# EAGLE design Wobbler_Rev1 (EAGLE 7.7.0)

## Sheet 1 of 5: MCU & Eeprom
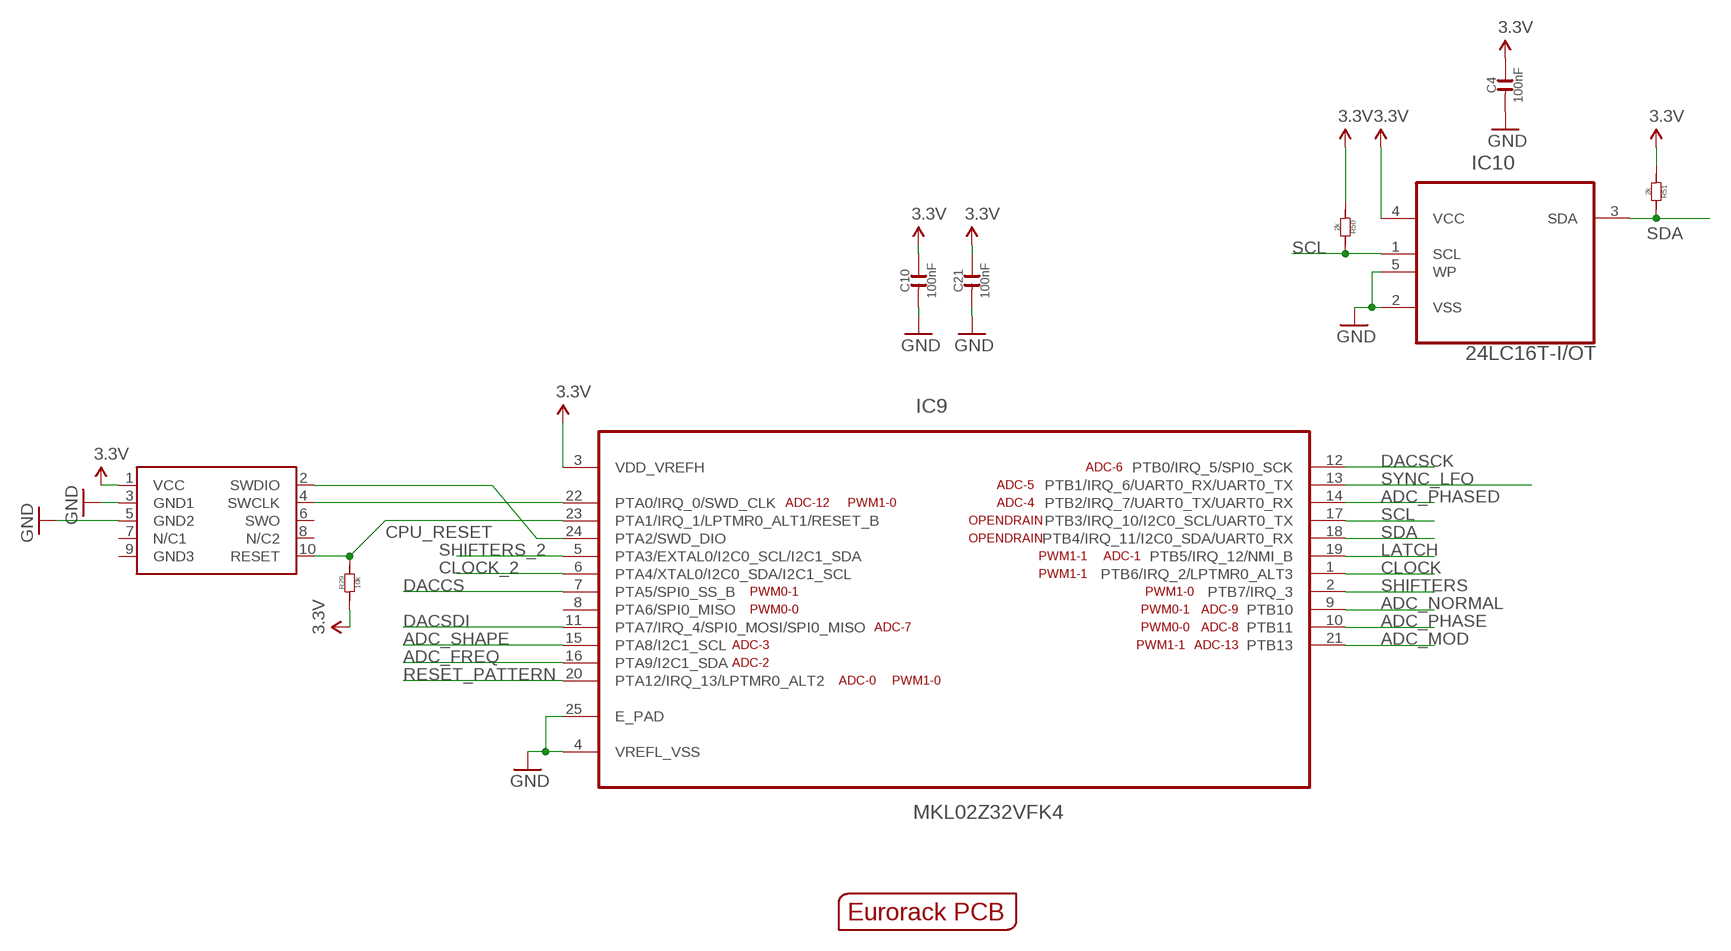
[diagram p0: schematic, sheet 1]

### Parts
C4  100nF  C-0603  [C0603]
C10  100nF  C-0603  [C0603]
C21  100nF  C-0603  [C0603]
IC9  MKL02Z32VFK4  [QFN50P400X400X100-25N]
IC10  24LC16T-I/OT  24LC00T-I/OT  [SOT95P290X145-5N]
OUTLINE  EURORACK_PCB12HP  [EURORACK12HPPCB]
R29  10k  R-0603  [R0603]
R50  2k  R-0603  [R0603]
R51  2k  R-0603  [R0603]
SWD1  CORTEX_SWD  [M50-3600542]

### Nets
3.3V [heavypower]: C4.2 C10.2 C21.2 IC9.3(VDD_VREFH) IC10.4(VCC) R29.1 R50.1 R51.1 SWD1.1(VCC) ; also sheet 2,3,4,5
ADC_FREQ: IC9.16(PTA9/I2C1_SDA) ; also sheet 5
ADC_MOD: IC9.21(PTB13) ; also sheet 5
ADC_NORMAL: IC9.9(PTB10) ; also sheet 5
ADC_PHASE: IC9.10(PTB11) ; also sheet 5
ADC_PHASED: IC9.14(PTB2/IRQ_7/UART0_TX/UART0_RX) ; also sheet 5
ADC_SHAPE: IC9.15(PTA8/I2C1_SCL) ; also sheet 5
CLOCK: IC9.1(PTB6/IRQ_2/LPTMR0_ALT3) ; also sheet 2
CLOCK_2: IC9.6(PTA4/XTAL0/I2C0_SDA/I2C1_SCL) ; also sheet 2
CPU_RESET: IC9.23(PTA1/IRQ_1/LPTMR0_ALT1/RESET_B) R29.2 SWD1.10(RESET)
DACCS: IC9.7(PTA5/SPI0_SS_B) ; also sheet 3
DACSCK: IC9.12(PTB0/IRQ_5/SPI0_SCK) ; also sheet 3
DACSDI: IC9.11(PTA7/IRQ_4/SPI0_MOSI/SPI0_MISO) ; also sheet 3
GND [groundplane]: C4.1 C10.1 C21.1 IC9.4(VREFL_VSS) IC9.25(E_PAD) IC10.2(VSS) IC10.5(WP) SWD1.3(GND1) SWD1.5(GND2) ; also sheet 2,3,4,5
LATCH: IC9.19(PTB5/IRQ_12/NMI_B) ; also sheet 2
RESET_PATTERN: IC9.20(PTA12/IRQ_13/LPTMR0_ALT2) ; also sheet 2,5
SCL: IC9.17(PTB3/IRQ_10/I2C0_SCL/UART0_TX) IC10.1(SCL) R50.2
SDA: IC9.18(PTB4/IRQ_11/I2C0_SDA/UART0_RX) IC10.3(SDA) R51.2
SHIFTERS: IC9.2(PTB7/IRQ_3) ; also sheet 2
SHIFTERS_2: IC9.5(PTA3/EXTAL0/I2C0_SCL/I2C1_SDA) ; also sheet 2
SWD_CLK: IC9.22(PTA0/IRQ_0/SWD_CLK) SWD1.4(SWCLK)
SWD_DIO: IC9.24(PTA2/SWD_DIO) SWD1.2(SWDIO)
SYNC_LFO: IC9.13(PTB1/IRQ_6/UART0_RX/UART0_TX) ; also sheet 5
Unconnected: IC9.8(PTA6/SPI0_MISO) SWD1.6(SWO) SWD1.7(N/C1) SWD1.8(N/C2) SWD1.9(GND3)

## Sheet 2 of 5: LEDs & button
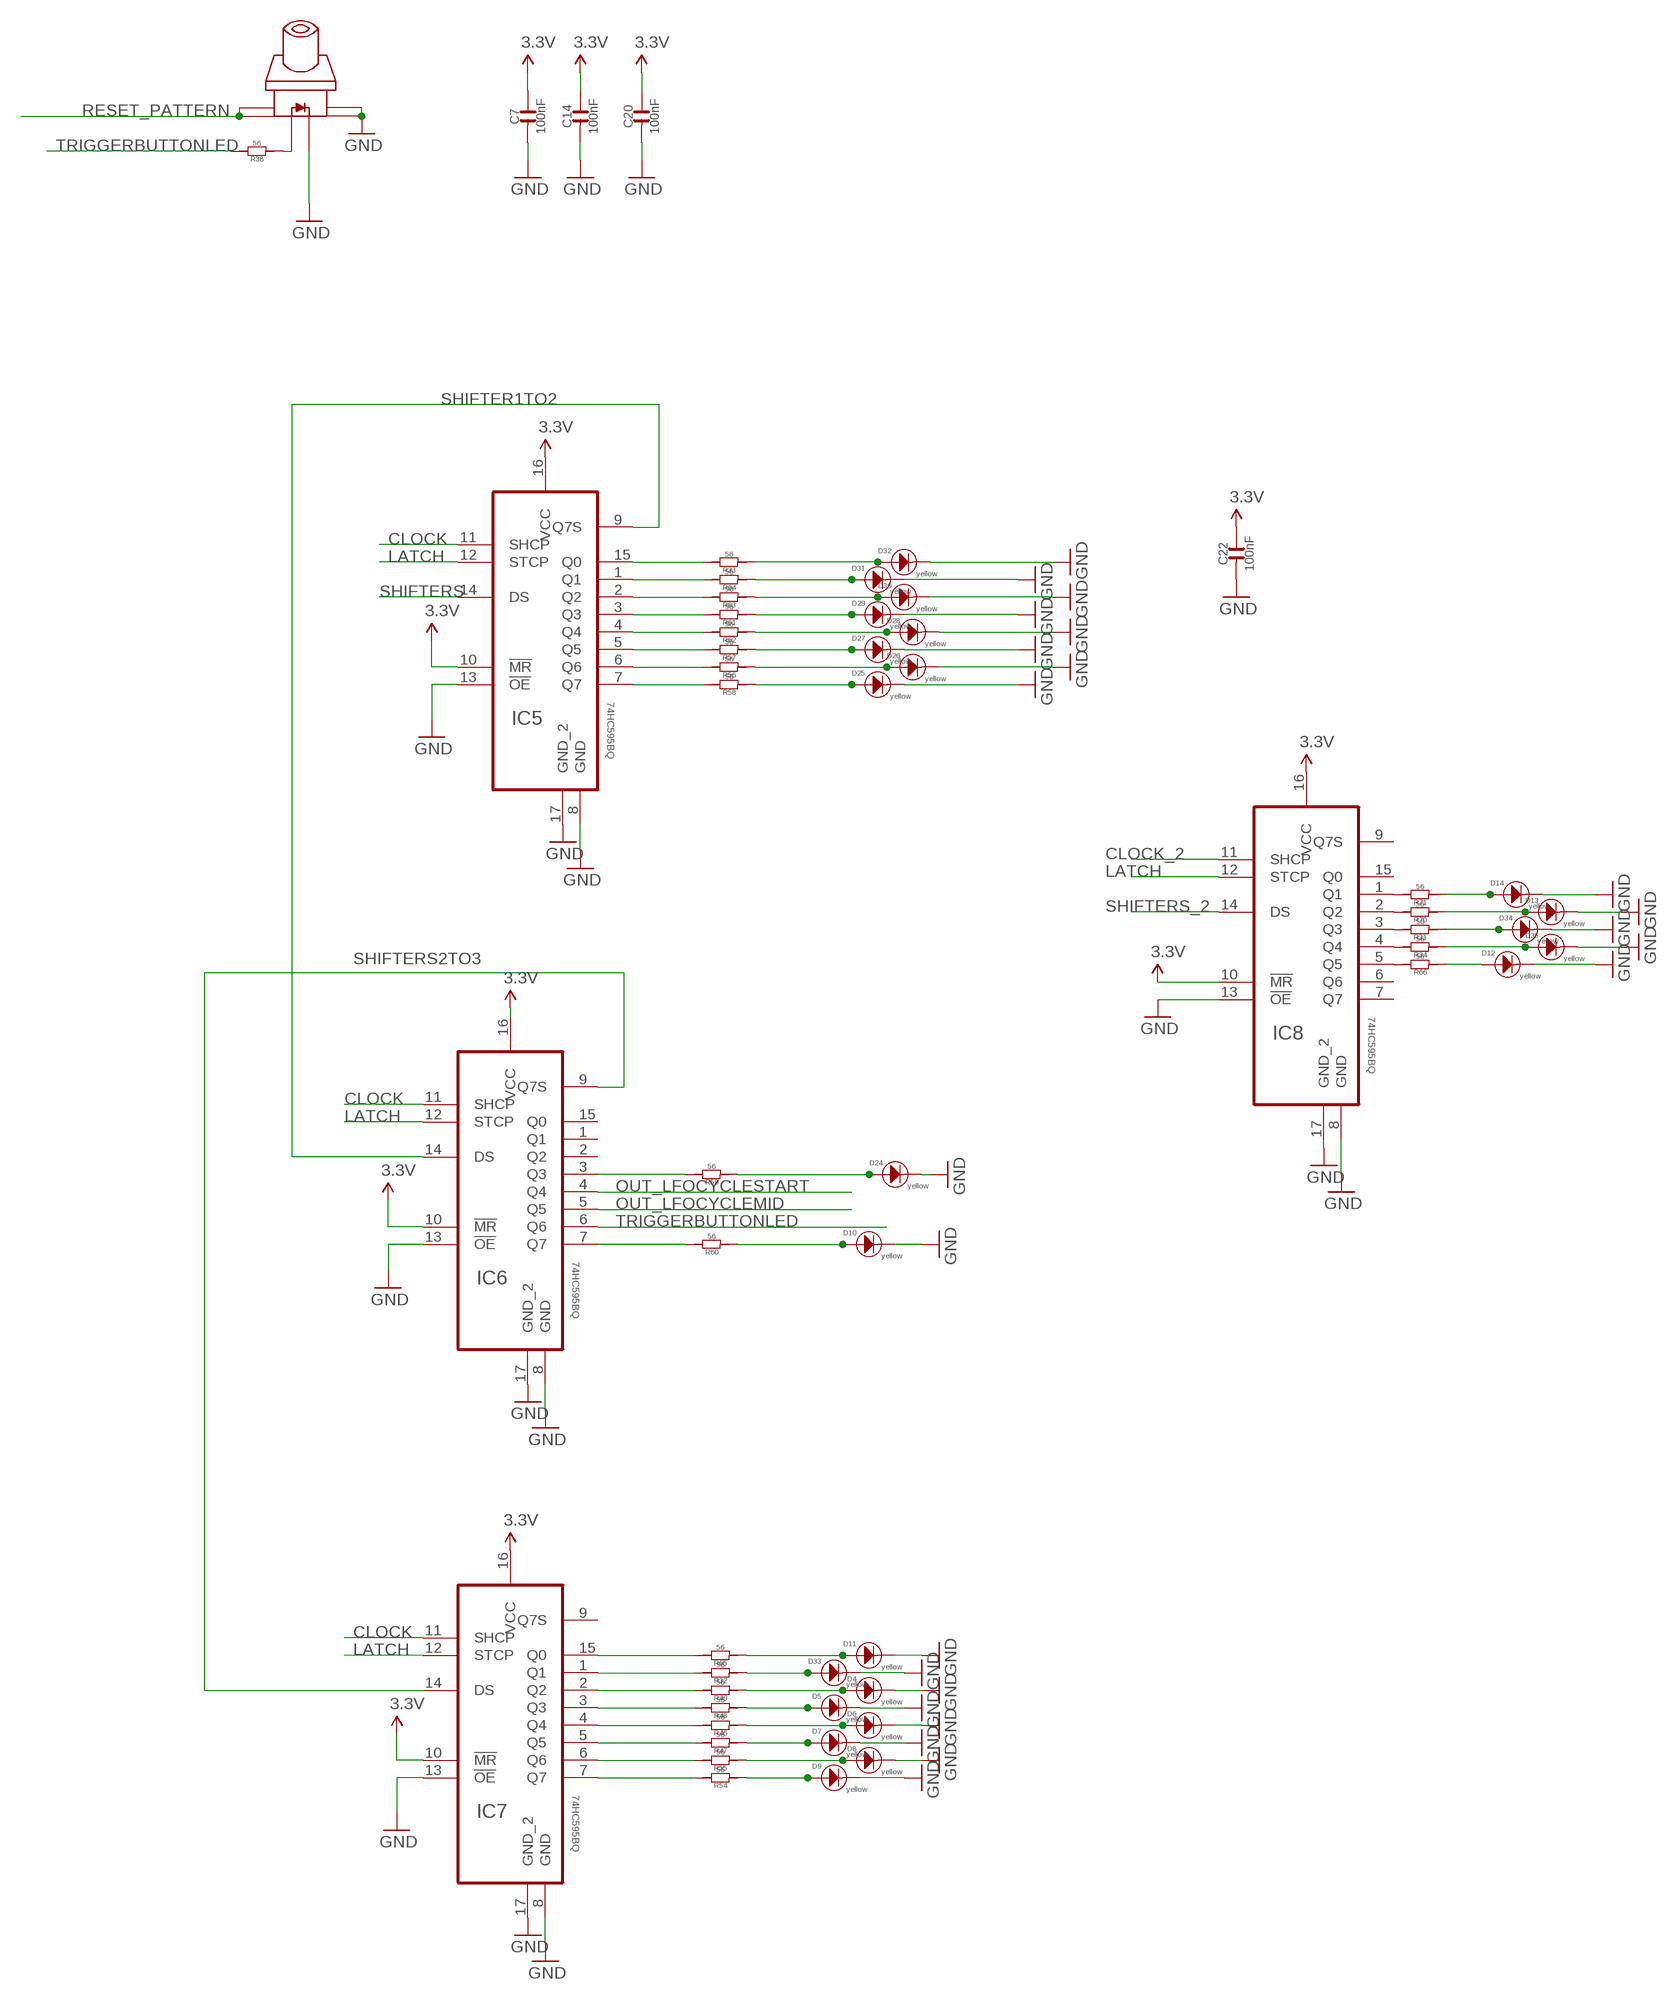
[diagram p1: schematic, sheet 2]

### Parts
C7  100nF  C-0603  [C0603]
C14  100nF  C-0603  [C0603]
C20  100nF  C-0603  [C0603]
C22  100nF  C-0603  [C0603]
D4  yellow  LED3MM  [3MMLED]
D5  yellow  LED3MM  [3MMLED]
D6  yellow  LED3MM  [3MMLED]
D7  yellow  LED3MM  [3MMLED]
D8  yellow  LED3MM  [3MMLED]
D9  yellow  LED3MM  [3MMLED]
D10  yellow  LED3MM  [3MMLED]
D11  yellow  LED3MM  [3MMLED]
D12  yellow  LED3MM  [3MMLED]
D13  yellow  LED3MM  [3MMLED]
D14  yellow  LED3MM  [3MMLED]
D24  yellow  LED3MM  [3MMLED]
D25  yellow  LED3MM  [3MMLED]
D26  yellow  LED3MM  [3MMLED]
D27  yellow  LED3MM  [3MMLED]
D28  yellow  LED3MM  [3MMLED]
D29  yellow  LED3MM  [3MMLED]
D30  yellow  LED3MM  [3MMLED]
D31  yellow  LED3MM  [3MMLED]
D32  yellow  LED3MM  [3MMLED]
D33  yellow  LED3MM  [3MMLED]
D34  yellow  LED3MM  [3MMLED]
D35  yellow  LED3MM  [3MMLED]
IC5  74HC595BQ  [QFN50P250X350X100-17N]
IC6  74HC595BQ  [QFN50P250X350X100-17N]
IC7  74HC595BQ  [QFN50P250X350X100-17N]
IC8  74HC595BQ  [QFN50P250X350X100-17N]
R31  56  R-0603  [R0603]
R32  56  R-0603  [R0603]
R33  56  R-0603  [R0603]
R34  56  R-0603  [R0603]
R38  56  R-0603  [R0603]
R46  56  R-0603  [R0603]
R47  56  R-0603  [R0603]
R48  56  R-0603  [R0603]
R49  56  R-0603  [R0603]
R54  56  R-0603  [R0603]
R55  56  R-0603  [R0603]
R56  56  R-0603  [R0603]
R57  56  R-0603  [R0603]
R58  56  R-0603  [R0603]
R59  56  R-0603  [R0603]
R60  56  R-0603  [R0603]
R61  56  R-0603  [R0603]
R62  56  R-0603  [R0603]
R63  56  R-0603  [R0603]
R64  56  R-0603  [R0603]
R65  56  R-0603  [R0603]
R66  56  R-0603  [R0603]
R70  56  R-0603  [R0603]
R71  56  R-0603  [R0603]
U$1  SWITCH_W_LED_PB6149L-X-102YELLOW  [PB6149L]

### Nets
3.3V [heavypower]: C7.2 C14.2 C20.2 C22.2 IC5.10(!MR) IC5.16(VCC) IC6.10(!MR) IC6.16(VCC) IC7.10(!MR) IC7.16(VCC) IC8.10(!MR) IC8.16(VCC) ; also sheet 1,3,4,5
CLOCK: IC5.11(SHCP) IC6.11(SHCP) IC7.11(SHCP) ; also sheet 1
CLOCK_2: IC8.11(SHCP) ; also sheet 1
GND [groundplane]: C7.1 C14.1 C20.1 C22.1 D4.- D5.- D6.- D7.- D8.- D9.- D10.- D11.- D12.- D13.- D14.- D24.- D25.- D26.- D27.- D28.- D29.- D30.- D31.- D32.- D33.- D34.- D35.- IC5.8(GND) IC5.13(!OE) IC5.17(GND_2) IC6.8(GND) IC6.13(!OE) IC6.17(GND_2) IC7.8(GND) IC7.13(!OE) IC7.17(GND_2) IC8.8(GND) IC8.13(!OE) IC8.17(GND_2) U$1.3 U$1.4 U$1.LEDNEG(NEG) ; also sheet 1,3,4,5
LATCH: IC5.12(STCP) IC6.12(STCP) IC7.12(STCP) IC8.12(STCP) ; also sheet 1
N$1: IC5.15(Q0) R33.2
N$14: D7.+ R47.1
N$19: IC5.1(Q1) R64.2
N$22: IC5.2(Q2) R63.2
N$26: IC5.3(Q3) R61.2
N$28: D28.+ R62.1
N$30: IC5.4(Q4) R62.2
N$31: IC5.5(Q5) R57.2
N$32: D29.+ R61.1
N$35: IC5.6(Q6) R56.2
N$36: IC5.7(Q7) R58.2
N$37: IC6.3(Q3) R59.2
N$38: IC7.7(Q7) R54.2
N$39: IC7.6(Q6) R55.2
N$40: IC7.5(Q5) R47.2
N$41: R38.1 U$1.LEDPOS(POS)
N$42: D13.+ R70.1
N$43: IC7.4(Q4) R46.2
N$46: D6.+ R46.1
N$47: D5.+ R48.1
N$48: D4.+ R49.1
N$49: D8.+ R55.1
N$50: D9.+ R54.1
N$51: D10.+ R60.1
N$52: D11.+ R65.1
N$53: IC7.3(Q3) R48.2
N$54: IC7.2(Q2) R49.2
N$55: IC7.1(Q1) R32.2
N$56: IC7.15(Q0) R65.2
N$57: IC6.7(Q7) R60.2
N$58: D14.+ R71.1
N$59: IC8.1(Q1) R71.2
N$62: IC8.2(Q2) R70.2
N$65: D12.+ R66.1
N$66: IC8.3(Q3) R31.2
N$67: IC8.4(Q4) R34.2
N$68: IC8.5(Q5) R66.2
N$73: D27.+ R57.1
N$74: D26.+ R56.1
N$75: D25.+ R58.1
N$76: D24.+ R59.1
N$77: D30.+ R63.1
N$78: D31.+ R64.1
N$79: D32.+ R33.1
N$80: D33.+ R32.1
N$81: D34.+ R31.1
N$82: D35.+ R34.1
OUT_LFOCYCLEMID: IC6.5(Q5) ; also sheet 3
OUT_LFOCYCLESTART: IC6.4(Q4) ; also sheet 3
RESET_PATTERN: U$1.1 U$1.2 ; also sheet 1,5
SHIFTER1TO2: IC5.9(Q7S) IC6.14(DS)
SHIFTERS: IC5.14(DS) ; also sheet 1
SHIFTERS2TO3: IC6.9(Q7S) IC7.14(DS)
SHIFTERS_2: IC8.14(DS) ; also sheet 1
TRIGGERBUTTONLED: IC6.6(Q6) R38.2
Unconnected: IC6.1(Q1) IC6.2(Q2) IC6.15(Q0) IC7.9(Q7S) IC8.6(Q6) IC8.7(Q7) IC8.9(Q7S) IC8.15(Q0)

## Sheet 3 of 5: DAC & Trigger outs
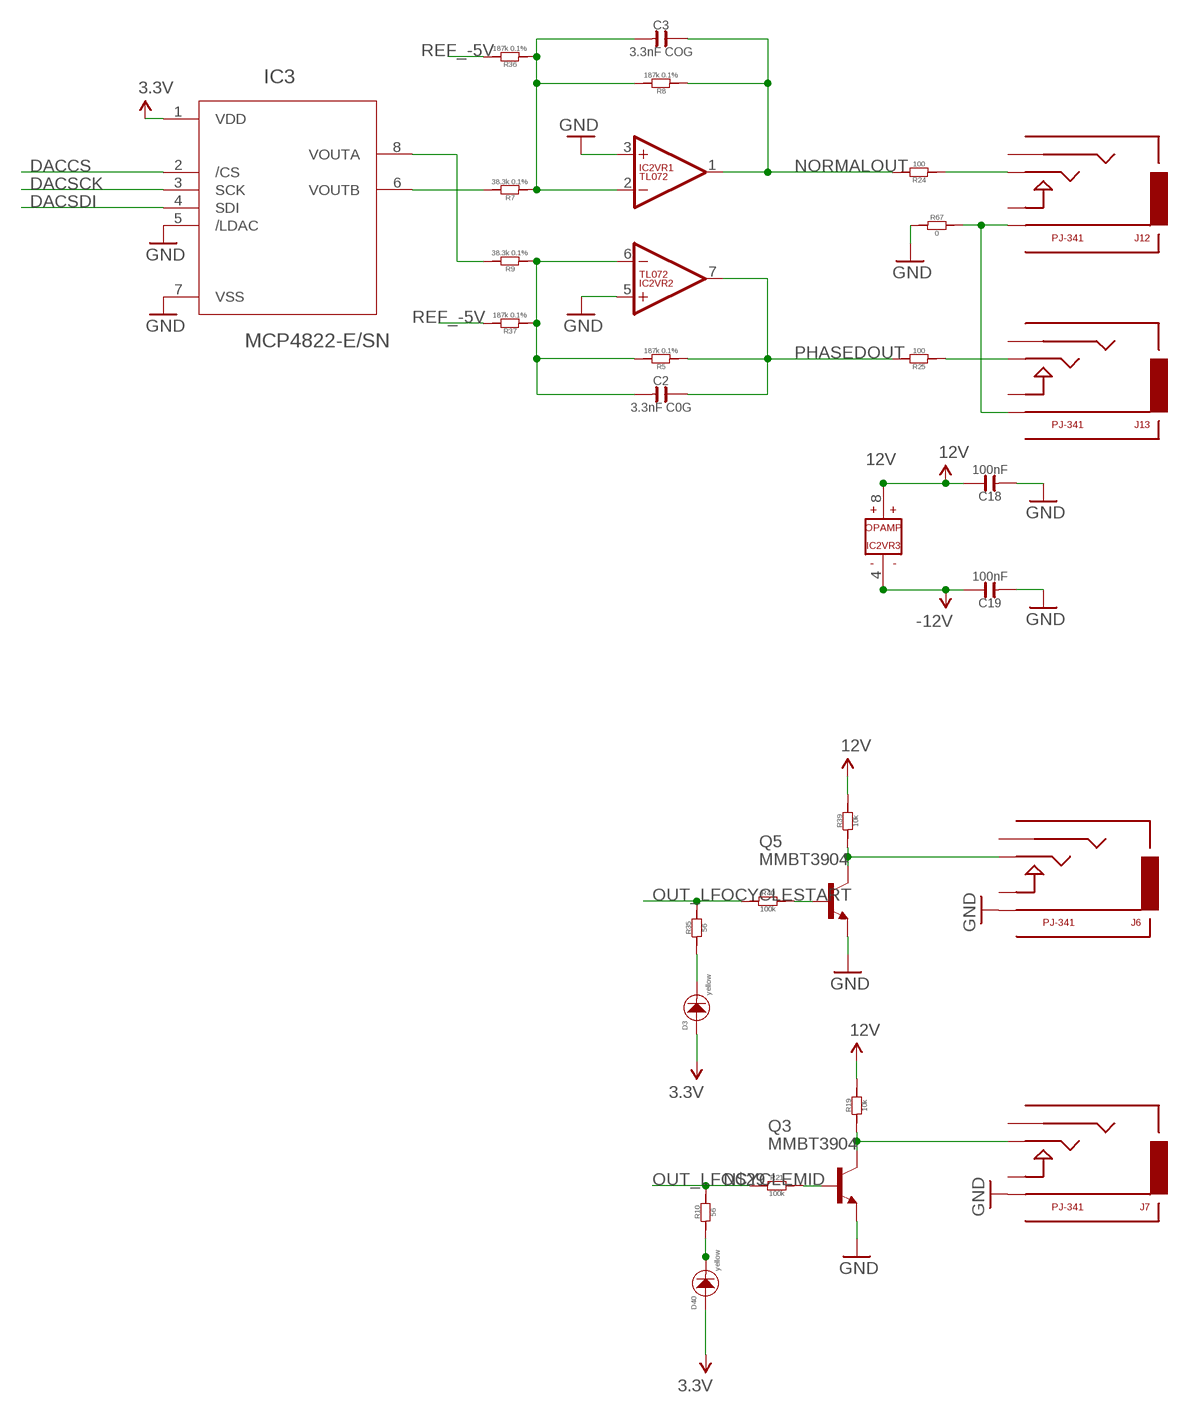
[diagram p2: schematic, sheet 3]

### Parts
C2  3.3nF C0G  C-0603  [C0603]
C3  3.3nF COG  C-0603  [C0603]
C18  100nF  C-0603  [C0603]
C19  100nF  C-0603  [C0603]
D3  yellow  LED3MM  [3MMLED]
D40  yellow  LED3MM  [3MMLED]
IC2  TL072  [SO08]
IC3  MCP4822-E/SN  [SOIC8-N_MC]
J6  PJ-341  AUDIO-JACKOUTPUT  [3.5MM-JACK-SWITCH-13MM-OUTPUT]
J7  PJ-341  AUDIO-JACKOUTPUT  [3.5MM-JACK-SWITCH-13MM-OUTPUT]
J12  PJ-341  AUDIO-JACKOUTPUT  [3.5MM-JACK-SWITCH-13MM-OUTPUT]
J13  PJ-341  AUDIO-JACKOUTPUT  [3.5MM-JACK-SWITCH-13MM-OUTPUT]
Q3  MMBT3904  MMBT3904LT1-NPN-SOT23-BEC  [SOT23-BEC]
Q5  MMBT3904  MMBT3904LT1-NPN-SOT23-BEC  [SOT23-BEC]
R5  187k 0.1%  R-0603  [R0603]
R7  38.3k 0.1%  R-0603  [R0603]
R8  187k 0.1%  R-0603  [R0603]
R9  38.3k 0.1%  R-0603  [R0603]
R10  56  R-0603  [R0603]
R19  10k  R-0603  [R0603]
R21  100k  R-0603  [R0603]
R24  100  R-0603  [R0603]
R25  100  R-0603  [R0603]
R35  56  R-0603  [R0603]
R36  187k 0.1%  R-0603  [R0603]
R37  187k 0.1%  R-0603  [R0603]
R39  10k  R-0603  [R0603]
R40  100k  R-0603  [R0603]
R67  0  R-0603  [R0603]

### Nets
3.3V [heavypower]: D3.+ D40.+ IC3.1(VDD) ; also sheet 1,2,4,5
12V [heavypower]: C18.2 IC2.8(VR3:V+) R19.2 R39.2 ; also sheet 4
-12V [heavypower]: C19.2 IC2.4(VR3:V-) ; also sheet 4
DACCS: IC3.2(/CS) ; also sheet 1
DACSCK: IC3.3(SCK) ; also sheet 1
DACSDI: IC3.4(SDI) ; also sheet 1
GND [groundplane]: C18.1 C19.1 IC2.3(VR1:+IN) IC2.5(VR2:+IN) IC3.5(/LDAC) IC3.7(VSS) J6.RING@3(RING) J7.RING@3(RING) Q3.E Q5.E R67.1 ; also sheet 1,2,4,5
N$5: IC3.8(VOUTA) R9.2
N$7: IC3.6(VOUTB) R7.2
N$9: C2.1 IC2.6(VR2:-IN) R5.2 R9.1 R37.1
N$10: C3.1 IC2.2(VR1:-IN) R7.1 R8.2 R36.1
N$20: J13.TIP@3(TIP) R25.1
N$21: J12.TIP@3(TIP) R24.1
N$23: D40.- R10.1
N$25: Q3.B R21.2
N$27: D3.- R35.1
N$29: J7.TIP@3(TIP) Q3.C R19.1
N$60: Q5.B R40.2
N$61: J6.TIP@3(TIP) Q5.C R39.1
NORMALOUT: C3.2 IC2.1(VR1:OUT) R8.1 R24.2
OUT_LFOCYCLEMID: R10.2 R21.1 ; also sheet 2
OUT_LFOCYCLESTART: R35.2 R40.1 ; also sheet 2
PHASEDOUT: C2.2 IC2.7(VR2:OUT) R5.1 R25.2
REF_-5V: R36.2 R37.2 ; also sheet 4,5
RETURNGROUND [returnground]: J12.RING@3(RING) J13.RING@3(RING) R67.2
Unconnected: J6.SECOND@3(SECOND) J6.SWITCH@3(SWITCH) J7.SECOND@3(SECOND) J7.SWITCH@3(SWITCH) J12.SECOND@3(SECOND) J12.SWITCH@3(SWITCH) J13.SECOND@3(SECOND) J13.SWITCH@3(SWITCH)

## Sheet 4 of 5: Power
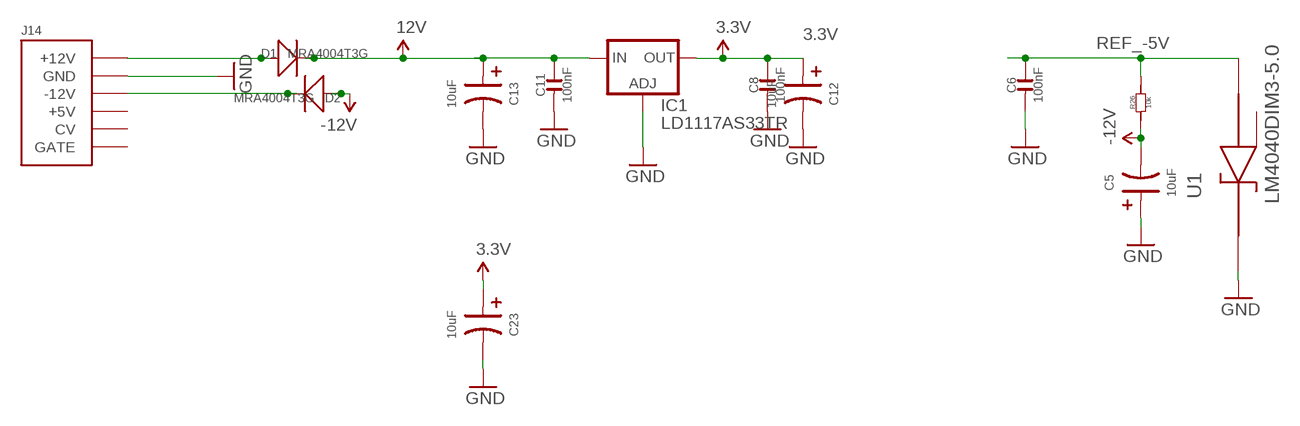
[diagram p3: schematic, sheet 4]

### Parts
C5  10uF  C-POLAR-A  [AVX-A]
C6  100nF  C-0603  [C0603]
C8  100nF  C-0603  [C0603]
C11  100nF  C-0603  [C0603]
C12  10uF  C-POLAR-A  [AVX-A]
C13  10uF  C-POLAR-A  [AVX-A]
C23  10uF  C-POLAR-A  [AVX-A]
D1  MRA4004T3G  D-SMA  [DO-214AC]
D2  MRA4004T3G  D-SMA  [DO-214AC]
IC1  LD1117AS33TR  [SOT223]
J14  POWERSMT  [2X08_SMT_HEADER]
R26  10k  R-0603  [R0603]
U1  LM4040DIM3-5.0  [SOT95P237X112-3N]

### Nets
3.3V [heavypower]: C8.2 C12.+ C23.+ IC1.2(OUT) IC1.4(OUT) ; also sheet 1,2,3,5
12V [heavypower]: C11.2 C13.+ D1.2(-) IC1.3(IN) ; also sheet 3
-12V [heavypower]: C5.- D2.1(+) R26.1 ; also sheet 3
GND [groundplane]: C5.+ C6.1 C8.1 C11.1 C12.- C13.- C23.- IC1.1(ADJ) J14.3(GND) J14.4(GND) J14.5(GND) J14.6(GND) J14.7(GND) J14.8(GND) U1.1(CATHODE) ; also sheet 1,2,3,5
N$13 [heavypower]: D1.1(+) J14.9(+12V) J14.10(+12V)
N$64 [heavypower]: D2.2(-) J14.1(-12V) J14.2(-12V)
REF_-5V: C6.2 R26.2 U1.2(ANODE) ; also sheet 3,5
Unconnected: J14.11(+5V) J14.12(+5V) J14.13(CV) J14.14(CV) J14.15(GATE) J14.16(GATE) U1.3(NC)

## Sheet 5 of 5: Inputs & Knobs
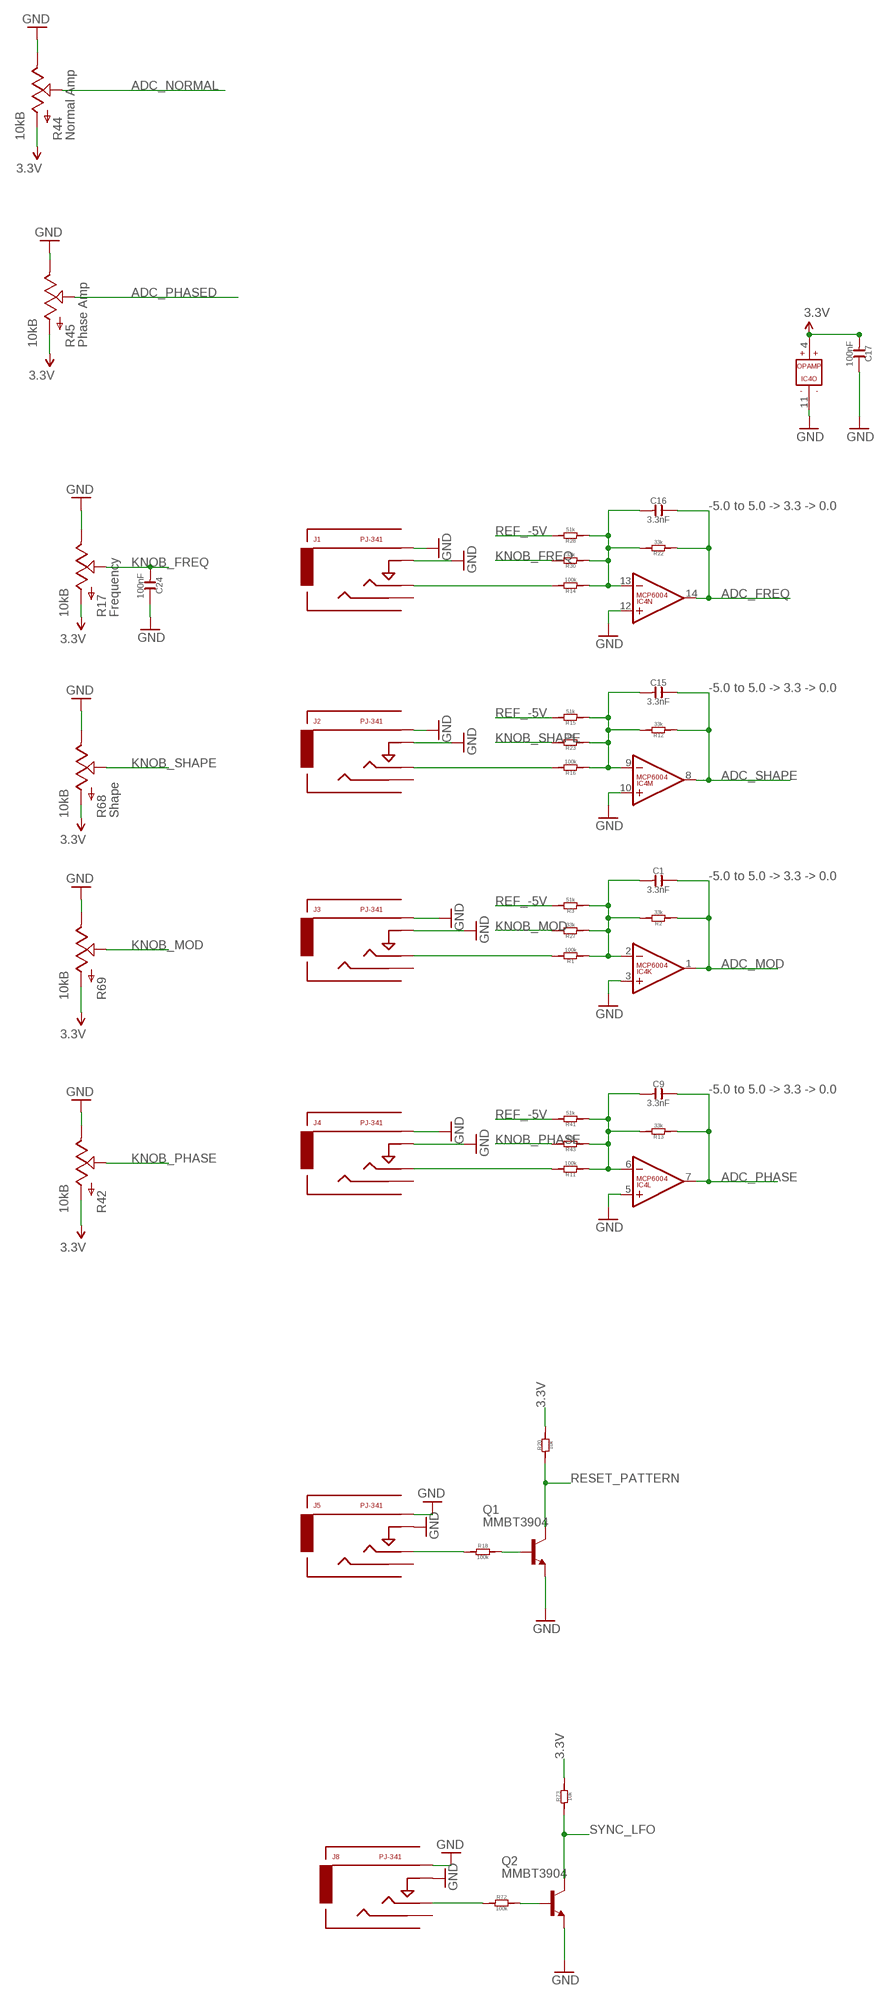
[diagram p4: schematic, sheet 5]

### Parts
C1  3.3nF  C-0603  [C0603]
C9  3.3nF  C-0603  [C0603]
C15  3.3nF  C-0603  [C0603]
C16  3.3nF  C-0603  [C0603]
C17  100nF  C-0603  [C0603]
C24  100nF  C-0603  [C0603]
IC4  MCP6004  [SO14]
J1  PJ-341  AUDIO-JACKINPUT  [3.5MM-JACK-SWITCH-13MM-INPUT]
J2  PJ-341  AUDIO-JACKINPUT  [3.5MM-JACK-SWITCH-13MM-INPUT]
J3  PJ-341  AUDIO-JACKINPUT  [3.5MM-JACK-SWITCH-13MM-INPUT]
J4  PJ-341  AUDIO-JACKINPUT  [3.5MM-JACK-SWITCH-13MM-INPUT]
J5  PJ-341  AUDIO-JACKINPUT  [3.5MM-JACK-SWITCH-13MM-INPUT]
J8  PJ-341  AUDIO-JACKINPUT  [3.5MM-JACK-SWITCH-13MM-INPUT]
Q1  MMBT3904  MMBT3904LT1-NPN-SOT23-BEC  [SOT23-BEC]
Q2  MMBT3904  MMBT3904LT1-NPN-SOT23-BEC  [SOT23-BEC]
R1  100k  R-0603  [R0603]
R2  33k  R-0603  [R0603]
R3  51k  R-0603  [R0603]
R11  100k  R-0603  [R0603]
R12  33k  R-0603  [R0603]
R13  33k  R-0603  [R0603]
R14  100k  R-0603  [R0603]
R15  51k  R-0603  [R0603]
R16  100k  R-0603  [R0603]
R17  10kB  POTZEPHPOT  [OG-POTS_ALPS_POT_VERTICAL]
R18  100k  R-0603  [R0603]
R20  10k  R-0603  [R0603]
R22  33k  R-0603  [R0603]
R23  33k  R-0603  [R0603]
R27  33k  R-0603  [R0603]
R28  51k  R-0603  [R0603]
R30  33k  R-0603  [R0603]
R41  51k  R-0603  [R0603]
R42  10kB  POTZEPHPOT  [OG-POTS_ALPS_POT_VERTICAL]
R43  33k  R-0603  [R0603]
R44  10kB  POTZEPHPOT  [OG-POTS_ALPS_POT_VERTICAL]
R45  10kB  POTZEPHPOT  [OG-POTS_ALPS_POT_VERTICAL]
R68  10kB  POTZEPHPOT  [OG-POTS_ALPS_POT_VERTICAL]
R69  10kB  POTZEPHPOT  [OG-POTS_ALPS_POT_VERTICAL]
R72  100k  R-0603  [R0603]
R73  10k  R-0603  [R0603]

### Nets
3.3V [heavypower]: C17.1 IC4.4(O:V+) R17.P$3(A) R20.2 R42.P$3(A) R44.P$3(A) R45.P$3(A) R68.P$3(A) R69.P$3(A) R73.2 ; also sheet 1,2,3,4
ADC_FREQ: C16.2 IC4.14(N:OUT) R22.1 ; also sheet 1
ADC_MOD: C1.2 IC4.1(K:OUT) R2.1 ; also sheet 1
ADC_NORMAL: R44.P$2(S) ; also sheet 1
ADC_PHASE: C9.2 IC4.7(L:OUT) R13.1 ; also sheet 1
ADC_PHASED: R45.P$2(S) ; also sheet 1
ADC_SHAPE: C15.2 IC4.8(M:OUT) R12.1 ; also sheet 1
GND [groundplane]: C17.2 C24.2 IC4.3(K:+IN) IC4.5(L:+IN) IC4.10(M:+IN) IC4.11(O:V-) IC4.12(N:+IN) J1.RING@3(RING) J1.SWITCH@3(SWITCH) J2.RING@3(RING) J2.SWITCH@3(SWITCH) J3.RING@3(RING) J3.SWITCH@3(SWITCH) J4.RING@3(RING) J4.SWITCH@3(SWITCH) J5.RING@3(RING) J5.SWITCH@3(SWITCH) J8.RING@3(RING) J8.SWITCH@3(SWITCH) Q1.E Q2.E R17.P$1(E) R42.P$1(E) R44.P$1(E) R45.P$1(E) R68.P$1(E) R69.P$1(E) ; also sheet 1,2,3,4
KNOB_FREQ: C24.1 R17.P$2(S) R30.2
KNOB_MOD: R27.2 R69.P$2(S)
KNOB_PHASE: R42.P$2(S) R43.2
KNOB_SHAPE: R23.2 R68.P$2(S)
N$3: J2.TIP@3(TIP) R16.2
N$4: C15.1 IC4.9(M:-IN) R12.2 R15.1 R16.1 R23.1
N$6: J3.TIP@3(TIP) R1.2
N$8: C1.1 IC4.2(K:-IN) R1.1 R2.2 R3.1 R27.1
N$11: J4.TIP@3(TIP) R11.2
N$12: C9.1 IC4.6(L:-IN) R11.1 R13.2 R41.1 R43.1
N$15: Q1.B R18.2
N$16: J5.TIP@3(TIP) R18.1
N$33: J1.TIP@3(TIP) R14.2
N$34: C16.1 IC4.13(N:-IN) R14.1 R22.2 R28.1 R30.1
N$44: Q2.B R72.2
N$45: J8.TIP@3(TIP) R72.1
REF_-5V: R3.2 R15.2 R28.2 R41.2 ; also sheet 3,4
RESET_PATTERN: Q1.C R20.1 ; also sheet 1,2
SYNC_LFO: Q2.C R73.1 ; also sheet 1
Unconnected: J1.SECOND@3(SECOND) J2.SECOND@3(SECOND) J3.SECOND@3(SECOND) J4.SECOND@3(SECOND) J5.SECOND@3(SECOND) J8.SECOND@3(SECOND)

### Notes on the sheet
- -5.0 to 5.0 -> 3.3 -> 0.0
- -5.0 to 5.0 -> 3.3 -> 0.0
- -5.0 to 5.0 -> 3.3 -> 0.0
- -5.0 to 5.0 -> 3.3 -> 0.0

## Library data of the parts
C1-C3 C9 C15 C16 = OPL:C*; OC_FARNELL: unknown
C4 C7 C8 C10 C11 C14 C17-C22 C24 = OPL:C*; MF: MULTICOMP; MPN: MC0603F104Z160CT; OC_FARNELL: 1759017
C5 C12 C13 C23 = EurorackModularParts:C-POLAR*; MF: AVX; MPN: TAJB106K020RNJ; OC_FARNELL: 197427
C6 = OPL:C*; MF: AVX; MPN: 06035C104KAT2A; OC_FARNELL: 1301804
D1 D2 = OPL:D*: DIODE; MF: VISHAY; MPN: US1G-E3/5AT; OC_FARNELL: 9551824
D3-D14 D24-D35 D40 = EurorackModularParts:LED*: LED
IC1 = ld-components:LD1117A?*: Low drop fixed and adjustable positive voltage regulators 1 A Source: http://www.st.com/stonline/products/literature/ds/7194/ld1117axx.pdf; MF: STMICROELECTRONICS; MPN: LD1117AS33TR; OC_FARNELL: 1467776
IC2 = EurorackModularParts:TL072
IC3 = FarnellThings:MCP4822-E/SN: 12 Bit DAC; DESCRIPTION: 12 Bit DAC; MF: MICROCHIP; MPN: MCP4822-E/SN; OC_FARNELL: 1439414; OC_NEWARK: 31K2975; PACKAGE: SOIC-8; SUPPLIER: Microchip
IC4 = EurorackModularParts:MCP6004; MF: MICROCHIP; MPN: MCP6004-I/SL.; OC_FARNELL: 1605572
IC5-IC8 = FarnellThings:74HC595BQ: 8-bit serial-in, serial or parallel-out shift register,QFN-16; MF: NXP; MPN: 74HC595BQ; OC_FARNELL: 2164850; OC_NEWARK: 43W8000; PACKAGE: QFN-16; SUPPLIER: NXP
IC9 = FarnellThings:MKL02Z32VFK4: IC, MCU, 32BIT, CORTEX M0+, 48MHZ, QFN-24; MF: NXP; MPN: MKL02Z32VFK4; OC_FARNELL: 2321481; OC_NEWARK: 61W9887; PACKAGE: QFN-24; SUPPLIER: FREESCALE SEMICONDUCTOR
IC10 = EurorackModularParts:24LC00T-I/OT: IC, EEPROM 128BIT SERIAL 400KHZ SOT-23-5; MF: MICROCHIP; MPN: 24LC00T-I/OT; OC_FARNELL: 9757864; OC_NEWARK: 62K0574; PACKAGE: SOT-23-5; SUPPLIER: MICROCHIP
J1 = EurorackModularParts:AUDIO-JACK: Switching Mono 3.5mm Audio Jack from Erthenvar.; DESC: Frequency; OC_FARNELL: unknown
J2 = EurorackModularParts:AUDIO-JACK: Switching Mono 3.5mm Audio Jack from Erthenvar.; DESC: Shape; OC_FARNELL: unknown
J3 = EurorackModularParts:AUDIO-JACK: Switching Mono 3.5mm Audio Jack from Erthenvar.; DESC: Mod; OC_FARNELL: unknown
J4 = EurorackModularParts:AUDIO-JACK: Switching Mono 3.5mm Audio Jack from Erthenvar.; DESC: Phase; OC_FARNELL: unknown
J5 = EurorackModularParts:AUDIO-JACK: Switching Mono 3.5mm Audio Jack from Erthenvar.; DESC: Reset; OC_FARNELL: unknown
J6 = EurorackModularParts:AUDIO-JACK: Switching Mono 3.5mm Audio Jack from Erthenvar.; DESC: Loop; OC_FARNELL: unknown
J7 = EurorackModularParts:AUDIO-JACK: Switching Mono 3.5mm Audio Jack from Erthenvar.; DESC: Mid; OC_FARNELL: unknown
J8 = EurorackModularParts:AUDIO-JACK: Switching Mono 3.5mm Audio Jack from Erthenvar.; DESC: Sync; OC_FARNELL: unknown
J12 = EurorackModularParts:AUDIO-JACK: Switching Mono 3.5mm Audio Jack from Erthenvar.; DESC: Normal Out; OC_FARNELL: unknown
J13 = EurorackModularParts:AUDIO-JACK: Switching Mono 3.5mm Audio Jack from Erthenvar.; DESC: Phased Out; OC_FARNELL: unknown
J14 = EurorackModularParts:POWER; OC_FARNELL: unknown
OUTLINE = EurorackModularParts:EURORACK_PCB; OC_FARNELL: unknown
Q1-Q3 Q5 = transistor:*-NPN-: NPN Transistror BF959 corrected 2008.03.06; MF: NXP; MPN: PMBT3904,215; OC_FARNELL: 2336795
R1-R3 R5 R7-R16 R18-R41 R43 R46-R51 R54-R67 R70-R73 = OPL:R*; OC_FARNELL: unknown
R17 = EurorackModularParts:POT; DESC: Frequency; OC_FARNELL: unknown
R42 = EurorackModularParts:POT; DESC: Phase; OC_FARNELL: unknown
R44 = EurorackModularParts:POT; DESC: Normal Amp; OC_FARNELL: unknown
R45 = EurorackModularParts:POT; DESC: Phase Amp; OC_FARNELL: unknown
R68 = EurorackModularParts:POT; DESC: Shape; OC_FARNELL: unknown
R69 = EurorackModularParts:POT; DESC: Mod; OC_FARNELL: unknown
SWD1 = carrilib with jtags:CORTEX_SWD: .05" Cortex M Connector in SWD mode Manufacturer: Generic Part Number: Cortex M SWD Notes: I use Harwin M50-3600542 connectors; OC_FARNELL: unknown
U1 = FarnellThings:LM4040DIM3-5.0: IC, Precision Micropower Shunt Voltage Reference, 5V,SOT-23-3; MF: TEXAS INSTRUMENTS; MPN: LM4040DIM3-5.0; OC_FARNELL: 9778330; OC_NEWARK: 97K3489; PACKAGE: SOT-23-3; SUPPLIER: TEXAS INSTRUMENTS
U$1 = zephod-components:SWITCH_W_LED_PB6149L-X-102

## Net classes
0 default: width 0.203 mm, clearance 0.178 mm
1 heavypower: width 0.305 mm
2 mediumpower: width 0.254 mm
3 groundplane: width 0.203 mm, clearance 0.203 mm
4 returnground: width 0.356 mm

## Board
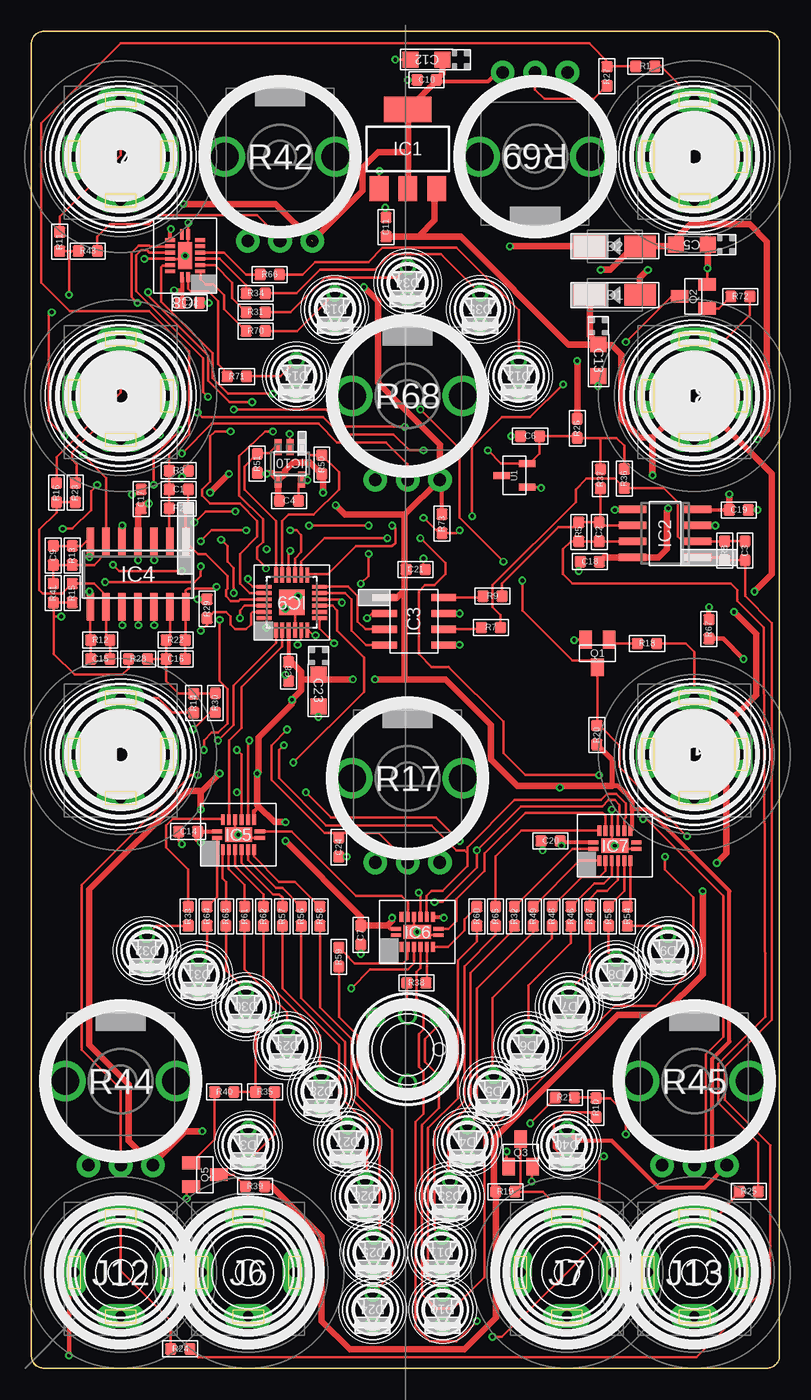
[diagram p5: board, top side]
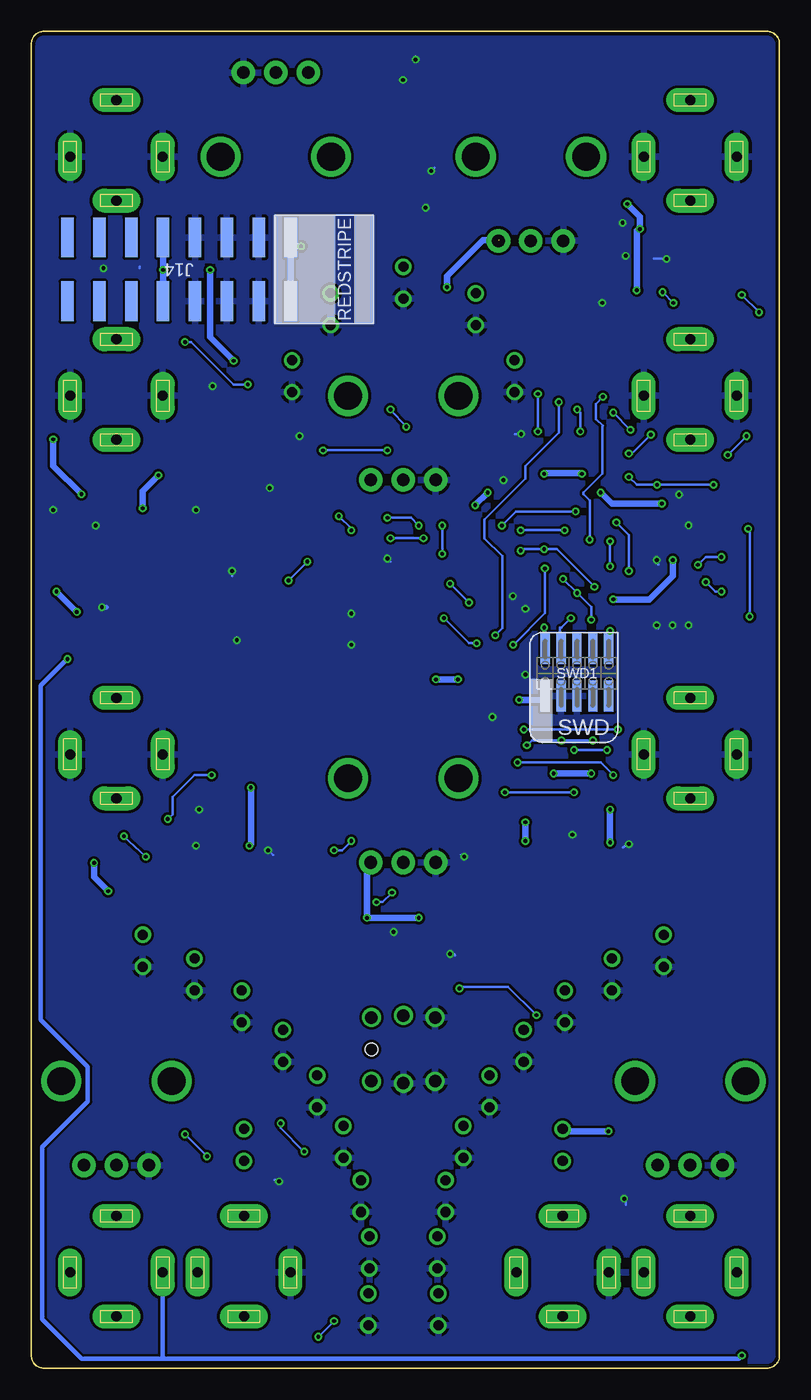
[diagram p6: board, bottom side, seen from below]

Size 59.62 x 106.5 mm. Coordinates in mm from the lower left corner, seen from the top.
Copper layers (1*16): Top 0.035mm / dielectric 1.5mm / Bottom 0.035mm
Design rules "dirt_cheap_dirty_boards.v1": minimum track width 5mil, minimum drill 12mil, track to track 5mil, track to pad 5mil, pad to pad 5mil, via to via 5mil, smd to smd 0mil, copper to edge 10mil, drill to drill 10mil, minimum pad ring 10mil, minimum via ring 6mil, stop-mask expansion 2mil, vias tented up to drill 25mil, thermal gap 10mil

### Footprints (pad centres in the part's own frame; a part is rotated, then mirrored left to right if it is on the bottom)
C0603 = smd 0.889 x 0.889: 1 -0.762,0; 2 0.762,0
AVX-A = smd 1.27 x 1.27: + -1.27,0; - 1.27,0
DO-214AC = smd 2.5 x 1.7: 1 -2,0; 2 2,0
3MMLED = drill 0.8: + -1.27,0; - 1.27,0
SOT223 = smd 1.5 x 2: 1 -2.3,-3.15; 2 0,-3.15; 3 2.3,-3.15 | smd 3.8 x 2: 4 0,3.15
SO08 = smd 0.6 x 2.2: 1 -1.905,-2.6; 2 -0.635,-2.6; 3 0.635,-2.6; 4 1.905,-2.6; 5 1.905,2.6; 6 0.635,2.6; 7 -0.635,2.6; 8 -1.905,2.6
SOIC8-N_MC = smd 1.981 x 0.559: 1 -2.362,1.905; 2 -2.362,0.635; 3 -2.362,-0.635; 4 -2.362,-1.905; 5 2.362,-1.905; 6 2.362,-0.635; 7 2.362,0.635; 8 2.362,1.905
SO14 = smd 0.6 x 2.2: 1 -3.81,-2.6; 2 -2.54,-2.6; 3 -1.27,-2.6; 4 0,-2.6; 5 1.27,-2.6; 6 2.54,-2.6; 7 3.81,-2.6; 8 3.81,2.6; 9 2.54,2.6; 10 1.27,2.6; 11 0,2.6; 12 -1.27,2.6; 13 -2.54,2.6; 14 -3.81,2.6
QFN50P250X350X100-17N = smd 0.305 x 0.813: 1 -0.254,1.702; 8 -0.254,-1.702; 9 0.254,-1.702; 16 0.254,1.702 | smd 0.813 x 0.305: 2 -1.194,1.245; 3 -1.194,0.762; 4 -1.194,0.254; 5 -1.194,-0.254; 6 -1.194,-0.762; 7 -1.194,-1.245; 10 1.194,-1.245; 11 1.194,-0.762; 12 1.194,-0.254; 13 1.194,0.254; 14 1.194,0.762; 15 1.194,1.245 | smd 1.143 x 2.159: 17 0,0
QFN50P400X400X100-25N = smd 1.2 x 0.3: 1 -2.2,1.245; 2 -2.2,0.762; 3 -2.2,0.254; 4 -2.2,-0.254; 5 -2.2,-0.762; 6 -2.2,-1.245; 13 2.2,-1.245; 14 2.2,-0.762; 15 2.2,-0.254; 16 2.2,0.254; 17 2.2,0.762; 18 2.2,1.245 | smd 0.3 x 1.2: 7 -1.245,-2.2; 8 -0.762,-2.2; 9 -0.254,-2.2; 10 0.254,-2.2; 11 0.762,-2.2; 12 1.245,-2.2; 19 1.245,2.2; 20 0.762,2.2; 21 0.254,2.2; 22 -0.254,2.2 | smd 0.305 x 1.2: 23 -0.762,2.2; 24 -1.245,2.2 | smd 2.032 x 2.032: 25 0,0
SOT95P290X145-5N = smd 1.27 x 0.559: 1 -1.295,0.94; 2 -1.295,0; 3 -1.295,-0.94; 4 1.295,-0.94; 5 1.295,0.94
3.5MM-JACK-SWITCH-13MM-INPUT = drill 0.8 pad 1.93 long: RING@3 -3.7,0; SECOND@3 0,-3.5; SWITCH@3 3.7,0; TIP@3 0,4.5
3.5MM-JACK-SWITCH-13MM-OUTPUT = drill 0.8 pad 1.93 long: RING@3 -3.7,0; SECOND@3 0,-3.5; SWITCH@3 3.7,0; TIP@3 0,4.5
2X08_SMT_HEADER = smd 1 x 3.17: 1 -8.89,-2.54; 2 -8.89,2.54; 3 -6.35,-2.54; 4 -6.35,2.54; 5 -3.81,-2.54; 6 -3.81,2.54; 7 -1.27,-2.54; 8 -1.27,2.54; 9 1.27,-2.54; 10 1.27,2.54; 11 3.81,-2.54; 12 3.81,2.54; 13 6.35,-2.54; 14 6.35,2.54; 15 8.89,-2.54; 16 8.89,2.54
SOT23-BEC = smd 1 x 1.4: B -0.95,-1.1; C 0,1.1; E 0.95,-1.1
R0603 = smd 0.889 x 0.889: 1 -0.762,0; 2 0.762,0
OG-POTS_ALPS_POT_VERTICAL = drill 1 pad 1.88: P$1 -2.58,-6.7; P$2 0,-6.7; P$3 2.58,-6.7 | drill 2.2 pad 3.175: P$4 4.4,0; P$5 -4.4,0
M50-3600542 = smd 0.75 x 2.5: 1 -2.54,-1.81; 2 -2.54,2; 3 -1.27,-1.81; 4 -1.27,2; 5 0,-1.81; 6 0,2; 7 1.27,-1.81; 8 1.27,2; 9 2.54,-1.81; 10 2.54,2
SOT95P237X112-3N = smd 1.321 x 0.559: 1 -1.016,0.94; 2 -1.016,-0.94; 3 1.016,0
PB6149L = drill 1: 1 2.54,2.54; 2 2.54,-2.54; 3 -2.54,2.54; 4 -2.54,-2.54; LEDNEG 0,-2.7; LEDPOS 0,2.7 | hole 1: 2.54,0

### Placement (x,y rotation side)
C1  11.75,70 0 top
C2  45.25,66.62 270 top
C3  56.88,65.12 270 top
C4  20.52,69.1 180 top
C5  52.62,89.5 180 top
C6  39.75,74.25 0 top
C7  26.25,34.5 90 top
C8  20.5,55.5 90 top
C9  1.75,64.75 90 top
C10  31.5,102.64 0 top
C11  28.27,90.91 270 top
C12  31.5,104.25 180 top
C13  45.2,80.29 270 top
C14  12.5,42.75 0 top
C15  5.5,56.5 180 top
C16  11.5,56.5 0 top
C17  8.75,69.25 90 top
C18  44.5,64.25 0 top
C19  56.38,68.38 180 top
C20  41.38,42 0 top
C21  30.62,63.62 180 top
C22  12.62,84.88 180 top
C23  22.88,54 270 top
C24  24.5,41.5 270 top
D1  46.5,85.5 180 top
D2  46.5,89.38 180 top
D3  17.28,17.78 270 top
D4  34.76,18.02 270 top
D5  36.85,22.05 270 top
D6  39.57,25.68 270 top
D7  42.86,28.81 270 top
D8  46.61,31.36 270 top
D9  50.74,33.25 270 top
D10  32.77,4.68 270 top
D11  32.69,9.21 270 top
D12  38.84,79.03 270 top
D13  24.19,84.36 270 top
D14  21.12,79.03 270 top
D24  27.19,4.68 270 top
D25  27.27,9.21 270 top
D26  26.6,13.7 270 top
D27  25.2,18.02 270 top
D28  23.11,22.05 270 top
D29  20.39,25.68 270 top
D30  17.1,28.81 270 top
D31  13.35,31.36 270 top
D32  9.22,33.25 270 top
D33  33.36,13.7 270 top
D34  29.98,86.47 270 top
D35  35.77,84.36 270 top
D40  42.68,17.78 270 top
IC1  30,97.13 0 top
IC2  50.5,66.5 90 top
IC3  30.5,59.5 0 top
IC4  8.5,63.25 180 top
IC5  16.5,42.5 90 top
IC6  30.75,34.75 90 top
IC7  46.5,41.62 90 top
IC8  12.25,88.62 180 top
IC9  20.75,61 90 top
IC10  20.61,72.08 270 top
J1  7.12,48.9 0 top
J2  7.12,77.47 0 top
J3  52.84,96.52 0 top
J4  7.12,96.52 0 top
J5  52.84,48.9 0 top
J6  17.28,7.62 0 top
J7  42.68,7.62 0 top
J8  52.84,77.47 0 top
J12  7.12,7.62 0 top
J13  52.84,7.62 0 top
J14  47.85,87.54 180 bottom
OUTLINE  -0.5,0 0 top
Q1  45.11,56.95 180 top
Q2  52.75,85.38 90 top
Q3  38.99,17.16 0 top
Q5  13.83,15.4 270 top
R1  48.93,103.71 0 top
R2  11.75,68.5 180 top
R3  11.75,71.5 0 top
R5  43.62,66.62 90 top
R7  36.62,59 180 top
R8  55.25,65.12 90 top
R9  36.75,61.5 180 top
R10  45,20.75 90 top
R11  2.25,89.75 90 top
R12  5.5,58 0 top
R13  3.25,64.75 270 top
R14  12.94,52.98 270 top
R15  3.25,61.75 270 top
R16  2,69.75 90 top
R17  29.98,46.99 0 top
R18  49.07,57.73 180 top
R19  37.77,14.05 180 top
R20  45.06,50.44 270 top
R21  42.51,21.55 180 top
R22  11.5,58 180 top
R23  3.5,69.75 90 top
R24  11.87,1.53 0 top
R25  57.17,14.07 0 top
R26  43.5,74.88 270 top
R27  45.87,102.92 270 top
R28  8.5,56.5 180 top
R29  14,60.5 270 top
R30  14.66,53 270 top
R31  17.88,84.12 180 top
R32  38.5,36 90 top
R33  12.5,36 90 top
R34  17.88,85.62 180 top
R35  18.62,22 180 top
R36  47.25,70.88 90 top
R37  45.36,70.84 90 top
R38  30.68,30.7 0 top
R39  17.82,14.47 0 top
R40  15.38,22 180 top
R41  1.75,61.75 270 top
R42  19.82,96.52 0 top
R43  4.5,89 0 top
R44  7.12,22.86 0 top
R45  52.84,22.86 0 top
R46  43,36 90 top
R47  44.5,36 90 top
R48  41.5,36 90 top
R49  40,36 90 top
R50  23.14,71.98 90 top
R51  18,72.08 90 top
R54  47.5,36 90 top
R55  46,36 90 top
R56  21.5,36 90 top
R57  20,36 90 top
R58  23,36 90 top
R59  24.5,32.75 90 top
R60  35.5,36 90 top
R61  17,36 90 top
R62  18.5,36 90 top
R63  15.5,36 90 top
R64  14,36 90 top
R65  37,36 90 top
R66  19,87.12 180 top
R67  54,58.88 270 top
R68  29.98,77.47 0 top
R69  40.14,96.52 180 top
R70  17.88,82.62 180 top
R71  16.38,79 180 top
R72  56.5,85.38 180 top
R73  32.72,67.28 90 top
SWD1  16.14,55.36 0 bottom
U1  38.5,71.12 180 top
U$1  29.98,25.4 0 top

### Tracks (layer width: path | path; a pad name or v marks a point on that pad's centre or on a via)
3.3V  (via drill 0.3)  (1 unrouted)
  Top 0.305: R51.1 18.75,71.32 | C14.2 IC5.16 | 32.52,70.77 R68.P$3 32.72,70.61 R73.2 | IC6.10 32.81,35.94 | IC7.10 47.88,42.95 47.88,44.5 49.12,44.5 55.62,38 55.62,26 54.25,24.62 54.25,17.33 R45.P$3 53.63,14.38 50,14.38 46.25,18.12 43.5,18.12 42.68,18.95 D40.+ | IC7.16 42.14,41.88 | IC5.10 17.75,44.37 18.12,44.75 | IC9.3 C8.2 | IC6.16 28.62,35 28.38,35.25 | C21.2 29.75,63.51 29.75,63.28 29.75,63.13 | R69.P$3 37.09,103.22 36.38,102.5 32.4,102.5 C10.2 | IC8.16 12,85.88 | 12,85.88 12,85.12 C22.2 | IC8.10 11.06,90.68 v11.12,90.75 | v11.38,85.88 12,85.88 | C23.+ 22.88,55.12 23.12,54.88
  Top 0.356: IC10.4 19.74,70.78
  Top 0.4: 47.88,44.5 47.88,45.25 46.75,46.38 46.25,46.38 46.25,48.48 R20.2
  Top 0.508: C4.2 19.67,69.19 IC10.4 19.13,71.32 18.75,71.32 v18.75,71.25 | 19.74,70.78 20.2,71.25 20.2,71.5 20.84,72.14 22.23,72.14 R50.1 23.25,71.12 v23.25,69.75 | IC1.2 30,96.88 | 30,96.88 IC1.4 32.26,102.54 C10.2 32.77,103.14 C12.+ | 30,96.88 27.62,96.88 26.38,95.62 26.38,93.8 R42.P$3 19.47,92.75 v12.12,92.75 | v20.75,53.25 21.5,54 21.5,54.88 | 21.5,54.88 21.5,55.5 20.74,56.26 C8.2 | 29.75,63.13 29.75,62 | 29.75,62 29.16,61.41 IC3.1 | 29.75,63.28 29.75,68 | 29.75,68 32.52,70.77 | v24.25,68.75 25,68 29.75,68 | 32.81,35.94 v32.88,35.88 | 20.88,53.12 v20.75,53.25 | C14.2 13.26,42.14 v13.5,41.88 | v13.5,44.5 13.5,45.88 13.62,46 | 13.62,46 v15,47.38 | v20.25,43.5 19.37,43.5 18.12,44.75 18,44.88 18,47.12 v18,47.38 18.12,47.5 18.12,50.25 20.75,52.88 v20.75,53.25 | v28.75,35.88 28.75,35.63 28.38,35.25 26.63,35.25 C7.2 26.25,36 v20.25,42 | 46.25,46.38 42.12,46.38 | 42.12,46.38 38.75,46.38 36.62,48.5 36.62,51.25 33,54.88 29.75,54.88 | 29.75,54.88 29.75,62 | 42.14,41.88 arc90 C20.2 42.12,41.99 v42.25,41.62 | v42.12,46.25 42.12,46.38 | 13.62,46 12.5,46 4.62,38.12 4.62,25.75 7.75,22.62 7.75,18.11 R44.P$3 9.7,16.32 12.25,18.88 v13.62,18.88 | R68.P$3 32.56,73.56 27.62,78.5 27.62,85 v26.5,86.12 | 29.75,54.88 v27.38,54.88 | v25.62,54.88 23.12,54.88 21.5,54.88 | v9.38,68.88 9.14,68.88 C17.1 8.5,68.49 IC4.4 v8.5,64.38 | v14.25,69.75 v15.75,71.25 | R29.1 13.99,61.25 v13.25,61.25
  Bottom 0.305: v11.12,90.75 11.25,90.75 | 22.34,89.88 22.05,90.17
  Bottom 0.356: v15.75,71.25 15.82,71.32
  Bottom 0.508: SWD1.1 18.89,53.25 v20.75,53.25 | v23.25,69.75 v24.25,68.75 | R17.P$3 32.88,39.98 v32.88,35.88 v28.75,35.88 | v13.5,41.88 v13.5,44.5 | v15,47.38 v18,47.38 | v20.25,42 v20.25,43.5 | v42.25,41.62 42.12,41.75 v42.12,46.25 | v27.38,54.88 v25.62,54.88 | 15.82,71.32 18.75,71.32 v18.75,71.25 | v13.25,61.25 10.38,61.25 8.5,63.12 v8.5,64.38 | v14.25,69.75 13.38,68.88 v9.38,68.88 | v13.62,18.88 17.11,18.88 D3.+ | 11.25,90.75 11.38,90.62 v11.38,85.88 | v12.12,92.75 11.12,91.75 v11.12,90.75 | v26.5,86.12 26.5,87 23.62,89.88 22.34,89.88
12V  (via drill 0.3)
  Top 0.305: 32.14,93.82 IC1.3 | 19.12,14.5 18.61,14.5 R39.2 | 45.26,81.5 C13.+ | v50.75,68.5 50.75,68.38
  Top 0.508: C11.2 30.85,90.15 | 30.85,90.15 32.14,91.44 32.14,93.82 | 30.85,90.15 34.23,90.15 42.81,81.56 C13.+ 44.5,82.26 D1.2 | 19.12,14.5 23.12,10.5 23.12,3.75 25.38,1.5 34.5,1.5 37,4 R19.2 36.88,14.68 36.88,18.25 46.75,28.12 50.25,28.12 53.5,31.38 v53.5,38 | v56,60.25 57.75,58.5 57.75,53.62 54.75,50.62 54.75,47 55.38,46.38 55.38,41 v54.62,40.25 | v57.62,61.88 59,63.25 59,71.25 54.5,75.75 51.12,75.75 49.5,74.12 | v49.5,71.12 49.5,74.12 | 45.26,81.5 46.25,81.5 47,80.75 47,75.62 48.5,74.12 49.5,74.12 | C18.2 45.61,64.59 IC2.8 49.97,64.59 50.62,65.25 50.62,68.25 50.75,68.38
  Bottom 0.508: v56,60.25 v57.62,61.88 | v53.5,38 54.62,39.12 v54.62,40.25 | v50.75,68.5 50.75,69.88 v49.5,71.12
-12V  (via drill 0.3)
  Top 0.305: 51.23,89.38 C5.- | D2.1 48,89.38 | R26.1 | 55.62,68.39 C19.2 53.27,68.41 IC2.4
  Top 0.508: D2.1 50.75,89.38 | 50.75,89.38 51.23,89.38 | 50.75,89.38 52.5,91.12 57.25,91.12 58.62,89.75 58.62,74.75 v57.88,74 | 48,89.38 46.12,87.5 v45.38,87.5 | v43.5,80.25 R26.1 | v55.62,69.62 55.62,68.39
  Bottom 0.508: v45.38,87.5 45.38,82.12 v43.5,80.25 | v57.88,74 57.88,71.88 v55.62,69.62
ADC_FREQ  (via drill 0.3)
  Top 0.203: C16.2 R22.1 12.31,58 IC4.14 12.31,61.94 12.5,62.12 14.62,62.12 v14.75,62.25 | v20.62,65.12 20.62,65.25 20.5,65.12 IC9.16
  Bottom 0.203: v20.62,65.12 20.5,65.25 v18.75,65.25 17.75,65.25 v14.75,62.25
ADC_MOD
  Top 0.203: C1.2 R2.1 12.31,68.5 IC4.1 13.29,64.88 13.88,64.88 15.62,63.12 15.62,62.12 15.5,62 15.5,61.5 15.88,61.12 16.5,61.12 16.62,61.25 IC9.21
ADC_NORMAL  (via drill 0.3)
  Top 0.203: IC9.9 24,60.75 24.38,60.38 24.38,58.75 26.5,56.62 26.5,53.88 v20.88,48.25 | R44.P$2 7.12,22.25 4,25.38 4,38.5 12.75,47.25 v13.25,47.25
  Bottom 0.203: v13.25,47.25 14.25,48.25 v20.88,48.25
ADC_PHASE  (via drill 0.3)
  Top 0.203: C9.2 R13.1 3.26,65.5 4,65.5 4.35,65.85 IC4.7 4.69,64.69 v4.62,64.62 | IC9.10 24.5,61.25 v24.75,61 | v6.5,64 7,63.5 v12,63.5 | v13,67.38 13.88,68.25 v16.25,68.25 | v26.25,62.5 26.88,63.12 v26.88,64.88 | v26.88,67.12 v22.12,67.12
  Bottom 0.203: v24.75,61 v26.25,62.5 | v4.62,64.62 5.88,64.62 v6.5,64 | v12,63.5 12,66.38 v13,67.38 | v26.88,64.88 v26.88,67.12 | v22.12,67.12 21,68.25 v16.25,68.25
ADC_PHASED  (via drill 0.3)
  Top 0.203: v28.38,66.12 23.38,66.12 21.5,64.25 21.5,63.21 IC9.14 | R45.P$2 53.75,17.07 53.75,25 55.12,26.38 55.12,37.62 49,43.75 v48.75,43.75 | v45.25,47.25 39.38,47.25 37.62,49 37.62,51.5 33.25,55.88 31.88,55.88 30.88,56.88 30.88,61.88 31.38,62.38 32.12,62.38 33,63.25 33,64.12 v31,66.12
  Bottom 0.203: v31,66.12 v28.38,66.12 | v48.75,43.75 48.38,44.12 48.38,45.5 46.62,47.25 v45.25,47.25
ADC_SHAPE  (via drill 0.3)
  Top 0.203: C15.2 R12.1 4.69,58.05 IC4.8 4.69,61.81 v4.62,61.88 | v5.88,62.62 13,62.62 13.5,63.12 v13.5,63.88 | IC9.15 21,64.5 21.5,65 21.5,66.38 21.12,66.75 v20.62,66.75 | v13.5,65.88 14.38,66.75 v17.12,66.75
  Bottom 0.203: v4.62,61.88 5.12,61.88 v5.88,62.62 | v20.62,66.75 v17.12,66.75 | v13.5,63.88 v13.5,65.88
CLOCK  (via drill 0.3)
  Top 0.203: IC7.11 47.26,43.76 47.38,43.88 47.38,45 46.62,45.75 45.88,45.75 45.38,45.25 38.5,45.25 34.75,41.5 34.75,41 | 34.75,41 34.75,40 32.75,38 31.88,38 31.5,37.62 31.5,35.96 IC6.11 | IC5.11 17.26,49.89 v17.38,50 | IC9.1 19.5,57.76 16.12,54.38 16.12,51.25 v14.88,50 | v20.12,49.62 19.75,49.25 19.75,47 23.5,43.25 31.88,43.25 33.88,41.25 34.5,41.25 34.75,41
  Bottom 0.203: v14.88,50 v17.38,50 19.75,50 v20.12,49.62
CLOCK_2  (via drill 0.3)
  Top 0.203: v22.65,58.39 22.45,58.39 22.07,58.77 IC9.6 | 11.03,89.34 IC8.11 10.93,89.34 9.5,89.34 9.41,89.44 8.55,89.44 7.98,88.87 7.98,85.34 v8.45,84.87 | v9.31,85.72 9.31,85.44 14.07,80.68 14.07,78.68 15.79,76.96 v17.59,76.96
  Bottom 0.203: v22.65,58.39 22.07,58.96 22.07,64.68 23.5,66.11 23.5,67.62 20.25,70.88 20.25,71.88 17.59,74.53 v17.59,76.96 | v9.31,85.72 v8.45,84.87
CPU_RESET  (via drill 0.3)
  Top 0.203: v13.5,58.75 14,59.25 R29.2 14.51,60.25 15.5,60.25 15.88,59.88 15.88,59.25 16.25,58.88 17.12,58.88 17.5,59.25 17.5,60.12 17.62,60.25 17.98,60.25 17.99,60.24 IC9.23
  Bottom 0.203: SWD1.10 13.5,56.97 v13.5,58.75
DACCS  (via drill 0.3)
  Top 0.203: IC9.7 22.95,58.92 v24.12,57.75 | v26.75,59.75 27.14,60.13 IC3.2
  Bottom 0.203: v24.12,57.75 24.75,57.75 v26.75,59.75
DACSCK
  Top 0.203: IC9.12 25.25,62.25 26,61.5 26,59.5 26.64,58.87 IC3.3
DACSDI
  Top 0.203: IC9.11 22.96,61.75 25,61.75 25.5,61.25 25.5,58.75 26.66,57.59 IC3.4
GND  (via drill 0.3)
  Top 0.203: C12.- v29,104.25 | C10.1 v30,102.64 | IC1.1 27.7,95.33 v27.75,95.38 | Q1.E 43.3,58.05 v43.25,58 | IC3.7 33.88,60.13 v34.12,60.12 | IC3.5 v34.12,57.62 | C21.1 31.21,63.71 v31.25,64.5 | IC10.2 20.61,74.39 v20.58,74.42 | C4.1 21.29,70.52 IC10.5 21.97,70.78 v22,70.75 | IC4.5 7.23,67.15 v7.25,67.14 | IC4.3 9.77,64.53 v9.79,64.39 | IC4.10 7.23,59.2 v7.25,59.18 | IC4.11 8.5,59.2 v8.52,59.18 | IC4.12 9.77,59.2 v9.79,59.18 | C13.- 45.2,78.52 v45.17,78.23 | C11.1 28.27,92.39 v28.2,92.46 | C17.2 8.79,69.64 v8.01,69.6 | C8.1 20.24,55 v20.25,55.25 | IC9.4 21,60.75 IC9.25 v20.25,60.5 | IC5.8 16.75,42.25 IC5.17 16.25,42.75 IC5.13 | C14.1 11.74,42.01 v12,41.75 | IC7.8 46.63,41.37 IC7.17 46.25,41.75 IC7.13 46.25,44.12 v46.25,44.5 | IC6.8 31,34.5 arc-90 IC6.17 arc-90 30.5,35 IC6.13 | C7.1 v26.25,33 | C20.1 40.75,42.26 v40.75,41.25 | Q5.E 12.38,14.46 v12.38,13.5 | Q3.E 39.88,15.99 v39.88,14.88 | C22.1 v14.12,84.88 | 53.9,87.64 v53.88,87.62 53.85,87.6 Q2.E | C6.1 v38.25,74.25 | U1.1 40.56,70.19 v40.62,70.12 | v12.5,91.25 IC8.8 12.5,88.88 IC8.17 12,88.37 IC8.13 v9,88.38 | C19.1 v57.88,68.38 | IC2.3 54.49,67.14 v54.5,67.12 | IC2.5 46.53,68.41 v46.5,68.38 | C18.1 43.74,63.61 v43.62,63.5 | C23.- v22.88,51.88 | C24.2 25.11,40.74 v25.12,40.75
  Top 0.4: R67.1 v54,60.62
  Top 0.5: C5.+ 53.9,87.64
  Bottom 0.203: v29,104.25 29,104.5 | v30,102.64 29.75,102.64 | v27.75,95.38 27.5,95.63 | v43.25,58 43.25,58.25 | v31.25,64.5 31,64.25 | v20.58,74.42 21.09,74.42 | v7.25,67.14 7.25,67.01 | v9.79,64.39 9.66,64.01 | v7.25,59.18 7.25,58.93 | v8.52,59.18 8.52,59.05 | v9.79,59.18 9.79,59.05 9.66,58.93 | v45.17,78.23 45.42,78.36 | v28.2,92.46 28.07,92.46 | v8.01,69.6 7.76,69.6 | v20.25,55.25 20.12,55.12 | v22,70.75 22,70.5 | v12,41.75 12.5,41.5 | 51,87.75 51,87.62 | v46.25,44.5 46.25,44.38 | v26.25,33 26,33 arc90 25.88,32.88 | v40.75,41.25 40.38,40.88 | v12.38,13.5 12.25,13.5 12.25,13 | v39.88,14.88 40,15 40.25,15 | v14.12,84.88 14.38,84.88 | v53.88,87.62 53.75,87.62 | v38.25,74.25 38,74.25 | v40.62,70.12 40.75,70.12 | v9,88.38 10,88.38 | v57.88,68.38 57.88,68.62 | v54.5,67.12 54.75,67.12 | v46.5,68.38 46.38,68.5 | v43.62,63.5 43.62,63.12 | v22.88,51.88 22.62,51.88 | v25.12,40.75 25.25,40.75 25.38,40.88
  Bottom 0.4: v54,60.62 53.62,60.62
  other vias: 21.25,61.5 30.75,34.75 46.5,41.62 16.5,42.5 12.25,88.62
  pour Bottom: -1.14,106.68 -5.58,-2.54 63,-1.91 63,109.86
KNOB_FREQ  (via drill 0.3)
  Top 0.203: R30.2 14.24,52.24 v12.88,50.88 | 30,40.31 R17.P$2 27.64,42.62 24.38,42.62 | 24.38,42.62 23.38,42.62 19.12,46.88 19.12,49.62 v20.38,50.88 | C24.1 24.5,42.5 24.38,42.62
  Bottom 0.203: v12.88,50.88 v20.38,50.88
KNOB_MOD
  Top 0.203: R69.P$2 40.14,101.86 40.88,101.12 44.84,101.12 R27.2
KNOB_PHASE
  Top 0.203: R43.2 5.25,89.01 5.25,90.12 6.25,91.12 9.38,91.12 10.12,91.88 18,91.88 19.82,90.06 R42.P$2
KNOB_SHAPE  (via drill 0.3)
  Top 0.203: R68.P$2 29.98,72.02 28.25,73.75 24.38,73.75 22.88,75.25 14.38,75.25 v12,72.88 | v10.25,74.38 9,75.62 5.88,75.62 3.25,73 3.25,72.38 3.62,72 3.62,70.64 R23.2
  Bottom 0.203: v12,72.88 11.75,72.88 v10.25,74.38
LATCH  (via drill 0.3)
  Top 0.203: IC7.12 46.75,44 46.88,44.12 46.88,44.88 46.5,45.25 46,45.25 45.5,44.75 39,44.75 v35.5,41.25 35.5,39.88 32.75,37.12 v32.12,37.12 | IC6.12 31,37.75 v30.88,37.88 | IC5.12 16.75,45.85 | 16.75,45.85 16.75,48.87 v16.38,49.25 | v13.75,49.25 13.75,50 14.38,50.62 14.88,50.62 15.62,51.38 15.62,54.12 15,54.75 v15,59.62 | 16.75,45.85 16.73,45.88 v16.38,45.88 | v17.25,62.88 17.25,62.62 17.62,62.25 18.5,62.25 IC9.19 | v21.88,45.88 23.88,43.88 32.25,43.88 v34.12,42 | v14.07,77.39 13.69,77.77 13.69,80.49 8.36,85.82 8.36,88.68 8.74,89.06 9.22,89.06 9.41,88.87 11.03,88.87 IC8.12 | v16.12,61.75 16.12,63.75 15.62,64.25 15.62,65.5 v15.12,66
  Bottom 0.203: v32.12,37.12 31.62,37.12 v30.88,37.88 | v16.38,49.25 v13.75,49.25 | v17.25,62.88 v16.12,61.75 15,60.62 v15,59.62 | v34.12,42 34.88,41.25 v35.5,41.25 | v16.38,45.88 v21.88,45.88 | v14.07,77.39 14.64,76.82 14.64,75.72 14.62,75.62 14.07,75.07 14.12,75.02 14.12,71.25 15.62,69.75 15.62,69.62 15.12,69.12 v15.12,66
N$1
  Top 0.203: R33.2 12.5,39.75 10.75,41.5 10.75,43.25 11.25,43.75 15.2,43.75 IC5.15
N$3
  Top 0.203: R16.2 2,72.6 7.12,77.72 J2.TIP@3
N$4
  Top 0.203: C15.1 R12.2 5.96,58.3 IC4.9 5.96,61.54 5,62.5 3.26,62.5 R15.1 2.46,61.72 0.9,61.72 0.64,61.98 0.64,66.8 2,68.16 R16.1 R23.1
N$5
  Top 0.203: IC3.8 36.14,61.41 R9.2
N$6
  Top 0.203: J3.TIP@3 50.13,103.77 R1.2
N$7
  Top 0.203: IC3.6 35.85,58.87 R7.2
N$8
  Top 0.203: IC4.2 10.99,65.85 R2.2 C1.1 R3.1 10.99,72.83 12.58,74.43 12.58,81.03 9.41,84.2 3.06,84.2 0.77,86.49 0.77,99.19 7.12,105.54 44.46,105.54 45.99,104 R27.1 45.9,103.71 R1.1
N$9
  Top 0.203: R9.1 37.5,62.5 42,67 43.24,67 R5.2 C2.1 | IC2.6 45.5,67.14 C2.1 | R37.1 45.36,67.49 C2.1
N$10
  Top 0.203: C3.1 R8.2 55.23,65.86 IC2.2 53.09,65.88 51.88,65.88 51.5,66.25 51.5,69 50.39,70.11 R36.1 46.49,70.88 44.25,70.88 43.38,70 43.38,69 36.75,62.38 36.75,60.62 37.39,59.99 R7.1
N$11
  Top 0.203: J4.TIP@3 7.12,96.62 2.25,91.75 R11.2
N$12  (via drill 0.3)
  Top 0.203: R41.1 C9.1 R13.2 3.26,64 5,64 5.96,64.96 IC4.6 5.96,70.92 v4.12,72.75 | R11.1 3.25,88.99 | 3.25,88.99 3.73,88.99 R43.1 | v2.62,74.25 1.38,75.5 1.38,83.88 v1.62,84.12 | v3,85.5 3,88.74 3.25,88.99
  Bottom 0.203: v4.12,72.75 v2.62,74.25 | v1.62,84.12 v3,85.5
N$13  (via drill 0.3)
  Top 0.508: D1.1 48.5,86.88 v49.12,87.5
  Bottom 0.305: v49.12,87.5
  Bottom 0.508: J14.10 v49.12,87.5 J14.9
N$14
  Top 0.203: R47.1 44.5,31.72 D7.+
N$15
  Top 0.203: Q1.B 46.38,57.73 R18.2
N$16
  Top 0.203: J5.TIP@3 52.84,57.03 52.14,57.73 R18.1
N$19
  Top 0.203: IC5.1 14.8,37.56 R64.2
N$20
  Top 0.203: J13.TIP@3 54.76,12.12 R25.1
N$21
  Top 0.203: J12.TIP@3 7.12,7.75 11.11,3.77 R24.1
N$22
  Top 0.203: R63.2 15.5,38.75 15.25,39 IC5.2
N$23
  Top 0.203: R10.1 44.61,20.38 42.5,20.38 41.62,19.5 41.62,17.57 D40.-
N$25  (via drill 0.3)
  Top 0.203: v39.75,19.5 41.5,21.25 R21.2 | Q3.B 37.88,16.22 v37.88,17.25
  Bottom 0.203: v37.88,17.25 39.75,19.12 v39.75,19.5
N$26
  Top 0.203: IC5.3 15.74,39.76 17,38.5 R61.2
N$27
  Top 0.203: D3.- 17.28,16.53 19.38,18.62 19.38,21.99 R35.1
N$28
  Top 0.203: D28.+ 23,23.43 23,26.5 18.5,31 R62.1
N$29
  Top 0.203: J7.TIP@3 40.75,14.05 R19.1 38.99,14.51 Q3.C
N$30
  Top 0.203: IC5.4 16.25,40 18.5,37.75 R62.2
N$31
  Top 0.203: IC5.5 16.75,40.25 19.25,37.75 19.75,37.75 20,37.5 R57.2
N$32
  Top 0.203: R61.1 17,31.75 20.39,28.36 D29.+
N$33
  Top 0.203: J1.TIP@3 10.11,53.4 11.25,52.25 12.9,52.25 R14.2
N$34
  Top 0.203: R28.1 C16.1 | C16.1 R22.2 11.04,58 IC4.13 | C16.1 10.74,54.76 11.75,53.75 13.68,53.75 R14.1 14.79,53.74 R30.1
N$35
  Top 0.203: IC5.6 17.26,40.49 19.5,38.25 20.01,38.25 R56.2
N$36
  Top 0.203: IC5.7 17.75,40.76 19.75,38.75 21.01,38.75 R58.2
N$37
  Top 0.203: IC6.3 29.99,32.61 29.62,32.25 25.75,32.25 25.25,32.75 25.26,32.75 R59.2
N$38
  Top 0.203: IC7.7 47.74,37.01 R54.2
N$39
  Top 0.203: IC7.6 47.26,38.02 R55.2
N$40
  Top 0.203: IC7.5 46.75,38.88 45.88,38 45.12,38 44.5,37.38 R47.2
N$41
  Top 0.203: R38.1 29.92,28.16 U$1.LEDPOS
N$42
  Top 0.203: R70.1 21.19,82.62 D13.+
N$43
  Top 0.203: IC7.4 46.25,39.25 45.62,38.62 44.86,38.62 R46.2
N$44
  Top 0.203: Q2.B 54.79,84.42 R72.2
N$45
  Top 0.203: J8.TIP@3 55.34,81.97 57.25,83.88 57.25,85.36 R72.1
N$46
  Top 0.203: R46.1 43,33.88 39.62,30.5 39.62,27 D6.+
N$47
  Top 0.203: R48.1 41.5,34.25 36.75,29.5 36.75,23.22 D5.+
N$48
  Top 0.203: R49.1 40,34.75 35.5,30.25 35.5,20.03 D4.+
N$49
  Top 0.203: R55.1 46,33.14 D8.+
N$50
  Top 0.203: 47.5,35.22 R54.1 50.02,35.24 D9.+
N$51
  Top 0.203: R60.1 35.5,34 34,32.5 34,21.5 31.62,19.12 31.62,7.25 32.77,6.11 D10.+
N$52
  Top 0.203: D11.+ 32.12,11.05 32.12,18.88 34.5,21.25 34.5,32 37,34.5 R65.1
N$53
  Top 0.203: IC7.3 45.74,39.61 45.25,39.12 43.86,39.12 R48.2
N$54
  Top 0.203: IC7.2 43.67,40.43 R49.2
N$55
  Top 0.203: IC7.1 43.11,41.37 R32.2
N$56
  Top 0.203: IC7.15 39.07,42.82 37,40.75 R65.2
N$57
  Top 0.203: IC6.7 33.18,33.56 34.5,34.88 34.5,35.76 R60.2
N$58
  Top 0.203: R71.1 17.17,79.03 19.85,79.03 D14.+
N$59
  Top 0.203: IC8.1 12.5,86 12.75,85.75 14.12,85.75 14.88,85 14.88,80 15.61,79.26 R71.2
N$60
  Top 0.203: R40.2 14.61,18.24 Q5.B
N$61
  Top 0.203: J6.TIP@3 17.28,14.25 R39.1 16.12,15.4 Q5.C
N$62
  Top 0.203: IC8.2 13.5,87.32 13.5,86.75 13.88,86.38 14.5,86.38 15.38,85.5 15.38,84.36 R70.2
N$64  (via drill 0.3)
  Top 0.508: D2.2 v38.12,89.38
  Bottom 0.508: J14.2 38.96,89.38 | 38.96,89.38 J14.1 | v38.12,89.38 38.96,89.38
N$65
  Top 0.203: R66.1 21.62,87.12 22.62,88.12 26.88,88.12 28,89.25 33.88,89.25 38.84,84.28 D12.+
N$66
  Top 0.203: IC8.3 13.46,87.88 14.62,87.88 16,86.5 16,85.24 R31.2
N$67
  Top 0.203: IC8.4 15,88.38 17.11,86.26 R34.2
N$68
  Top 0.203: IC8.5 15.38,88.88 17.12,87.12 R66.2
N$73
  Top 0.203: D27.+ 24.5,19.99 24.5,25.75 20,30.25 R57.1
N$74
  Top 0.203: D26.+ 26.75,15.37 26.75,19.5 25,21.25 25,26 21.5,29.5 R56.1
N$75
  Top 0.203: D25.+ 27.75,10.96 27.75,19.25 25.5,21.5 25.5,26.25 23,28.75 R58.1
N$76
  Top 0.203: D24.+ 28.75,7.5 28.75,19 26,21.75 26,26.5 24.5,28 R59.1
N$77
  Top 0.203: R63.1 15.5,31.68 D30.+
N$78
  Top 0.203: R64.1 14,33.28 D31.+
N$79
  Top 0.203: R33.1 9.94,35.24 D32.+
N$80
  Top 0.203: D33.+ 33.25,15.08 33.25,19.25 35,21 35,31.5 38.5,35 R32.1
N$81
  Top 0.203: R31.1 20.66,84.12 23.41,86.88 29.11,86.88 D34.+
N$82
  Top 0.203: R34.1 21.12,85.62 23,87.5 27.38,87.5 28.62,88.75 32.65,88.75 D35.+
NORMALOUT
  Top 0.203: R24.2 13.29,0.88 53,0.88 58.88,6.75 58.88,17.75 55.25,21.38 55.25,24 59,27.75 59,59.38 56.88,61.5 C3.2 R8.1 55.02,64.59 IC2.1
OUT_LFOCYCLEMID  (via drill 0.3)
  Top 0.203: IC6.5 31,31.88 30.69,31.56 30.69,29.5 31.25,28.94 31.25,27 30.88,26.62 30.88,24 31.25,23.62 31.25,20.25 30.62,19.62 30.62,3.25 31.75,2.12 33.88,2.12 v35.5,3.75 | v36.75,2.5 37.5,2.5 45.25,10.12 45.25,16.5 v45.62,16.88 | 43.02,21.4 R21.1 44.96,21.55 R10.2 45.01,21.5 46.12,21.5 47.38,20.25 v47.38,18.62
  Bottom 0.203: v35.5,3.75 v36.75,2.5 | v45.62,16.88 v47.38,18.62
OUT_LFOCYCLESTART  (via drill 0.3)
  Top 0.203: R40.1 R35.2 17.86,26.61 v19.38,28.12 | v25.5,30.25 27,31.75 30,31.75 30.5,32.25 IC6.4
  Bottom 0.203: v19.38,28.12 21.62,30.38 25.38,30.38 v25.5,30.25
PHASEDOUT
  Top 0.203: R25.2 57.93,17.95 54.75,21.12 54.75,24.25 58.5,28 58.38,58.86 58.38,59 56.25,61.12 56.25,62 55.75,62.5 43.12,62.5 42.38,63.25 42.38,65.25 42.99,65.86 R5.1 C2.2 | IC2.7 C2.2 | C2.2
REF_-5V  (via drill 0.3)
  Top 0.203: R15.2 R41.2 1.79,60.95 1.79,59.88 | R28.2 7.74,55.74 7.25,55.24 3.44,55.24 1.79,56.9 1.79,59.88 | R3.2 12.01,71 v12,71 | v5.25,70.38 4.75,69.88 4.75,68.38 3.25,66.88 v2.5,66.88 | v2.38,59.88 1.79,59.88 | v11.88,74.75 9.75,72.62 v9.75,70.38 | 45.25,74.11 R26.2 43.36,74.25 C6.2 40.5,74.24 40.5,72.88 39.69,72.06 U1.2 37.44,72.06 v36.38,73.12 | 45.25,74.11 46.64,74.11 47.25,73.5 R36.2 | v13.25,76.12 13.62,75.75 23.25,75.75 24.62,74.38 28.88,74.38 30.12,73.12 v31.25,73.12 | R37.2 45.36,74.01 45.25,74.11
  Bottom 0.203: v12,71 11.38,70.38 v9.75,70.38 v5.25,70.38 | v2.5,66.88 2.38,66.75 v2.38,59.88 | v11.88,74.75 v13.25,76.12 | v31.25,73.12 v36.38,73.12
RESET_PATTERN  (via drill 0.3)
  Top 0.203: IC9.20 18.54,61.75 17.38,61.75 16.62,62.5 16.62,64.88 18,66.25 18,67.5 16.62,68.88 14.25,68.88 13.62,69.5 13.62,70 14.25,70.62 14.25,74.25 14.62,74.62 v15.88,74.62 | Q1.C 45.11,51.25 R20.1 45.3,51.2 46.88,49.62 46.88,47.88 v52.25,42.38 | U$1.1 32.52,27.39 31.38,26.25 31.38,24.38 32.52,23.23 | 32.52,23.23 U$1.2 | 32.52,23.23 32.5,23.21 32.5,20.75 31.12,19.38 31.12,5.88 32.25,4.75 33.62,4.75 36.12,7.25 36.12,18.5 46.5,28.88 49.75,28.88 52.75,31.88 52.75,37.5 50.5,39.75 v50.5,40.75 | Q1.C 44.58,56.38 | v29.75,75 24.88,75 23.5,76.38 v16.12,76.38 | v31,76.38 34.12,73.25 34.12,67.75 v37.62,64.25 | v39.12,62.75 39.12,60.38 43.12,56.38 45.12,56.38 45.11,56.36 Q1.C
  Bottom 0.203: v50.5,40.75 v52.25,42.38 | v31,76.38 v29.75,75 | v37.62,64.25 v39.12,62.75 | v15.88,74.62 15.88,76.12 v16.12,76.38
RETURNGROUND  (via drill 0.3)
  Top 0.356: R67.2 55.14,58.11 v56.75,56.5 | v3,1 3,7.2 J12.RING@3
  Bottom 0.356: v56.75,56.5 58.88,54.38 58.88,27.75 55.12,24 55.12,21.25 58.75,17.62 58.75,3.88 55.62,0.75 49,0.75 | 49,0.75 3.25,0.75 v3,1 | J13.RING@3 49.14,0.89 49,0.75
SCL
  Top 0.203: IC10.1 22.18,72.75 R50.2 24.5,71.39 24.5,70 22.5,68 20.5,68 19.99,67.49 IC9.17
SDA
  Top 0.203: IC10.3 19.41,73.37 18.93,72.9 18.06,72.9 R51.2 17,71.84 17,70 19.5,67.5 IC9.18
SHIFTER1TO2
  Top 0.203: IC5.9 20.75,42.75 25.88,37.62 29.5,37.62 30,37.12 30,35.96 IC6.14
SHIFTERS
  Top 0.203: IC9.2 19.99,57.49 16.75,54.25 16.75,51 15.75,50 15.75,43.71 IC5.14
SHIFTERS2TO3
  Top 0.203: IC7.14 45.74,44.01 45.5,44.25 39.38,44.25 36.12,41 36.12,39.62 33.88,37.38 33.88,35.62 33.25,35 IC6.9
SHIFTERS_2  (via drill 0.3)
  Top 0.203: v19.25,77.62 17.41,77.63 15.69,77.63 14.45,78.87 14.45,80.87 10.36,84.96 10.36,87.72 10.45,87.82 11.03,87.82 IC8.14 | v19.25,74.62 18.62,74.62 16.55,72.68 16.55,69.53 18.45,67.63 18.45,65.82 18.07,65.44 18.06,65.44 18,65.38 18,64.5 18.7,63.8 v18.7,63.71 | v21.22,57.63 21.22,57.82 21.5,58.1 21.5,58.77 IC9.5
  Bottom 0.203: v19.25,74.62 v19.25,77.62 | v18.7,63.71 18.7,60.15 v21.22,57.63
SWD_CLK  (via drill 0.3)
  Top 0.203: IC9.22 17,60.75 16.62,60.38 v16.62,59.75
  Bottom 0.203: SWD1.4 17.5,56.95 17.5,59 17.38,59 v16.62,59.75
SWD_DIO  (via drill 0.3)
  Top 0.203: IC9.24 18.75,59.55 v18.75,59
  Bottom 0.203: v18.75,59 18.68,58.94 SWD1.2
SYNC_LFO  (via drill 0.3)
  Top 0.203: IC9.13 22.05,63.25 23.62,63.25 25.88,65.5 28.75,65.5 29,65.75 29,66.88 v28.75,67.12 | Q2.C 51,85.38 v47.38,81.75 | v31.25,67.75 32.49,66.51 R73.1 33.89,66.51 v34.12,66.75 | v42.38,78.38 39.75,75.75 37.5,75.75 35.12,73.38 v35.12,67.88
  Bottom 0.203: v47.38,81.75 46.88,81.75 43.5,78.38 v42.38,78.38 | v31.25,67.75 29.38,67.75 v28.75,67.12 | v34.12,66.75 34.12,66.88 v35.12,67.88
TRIGGERBUTTONLED
  Top 0.203: IC6.6 31.51,30.76 R38.2